# Altium project Hydro_USBL_PCB.PrjPcb
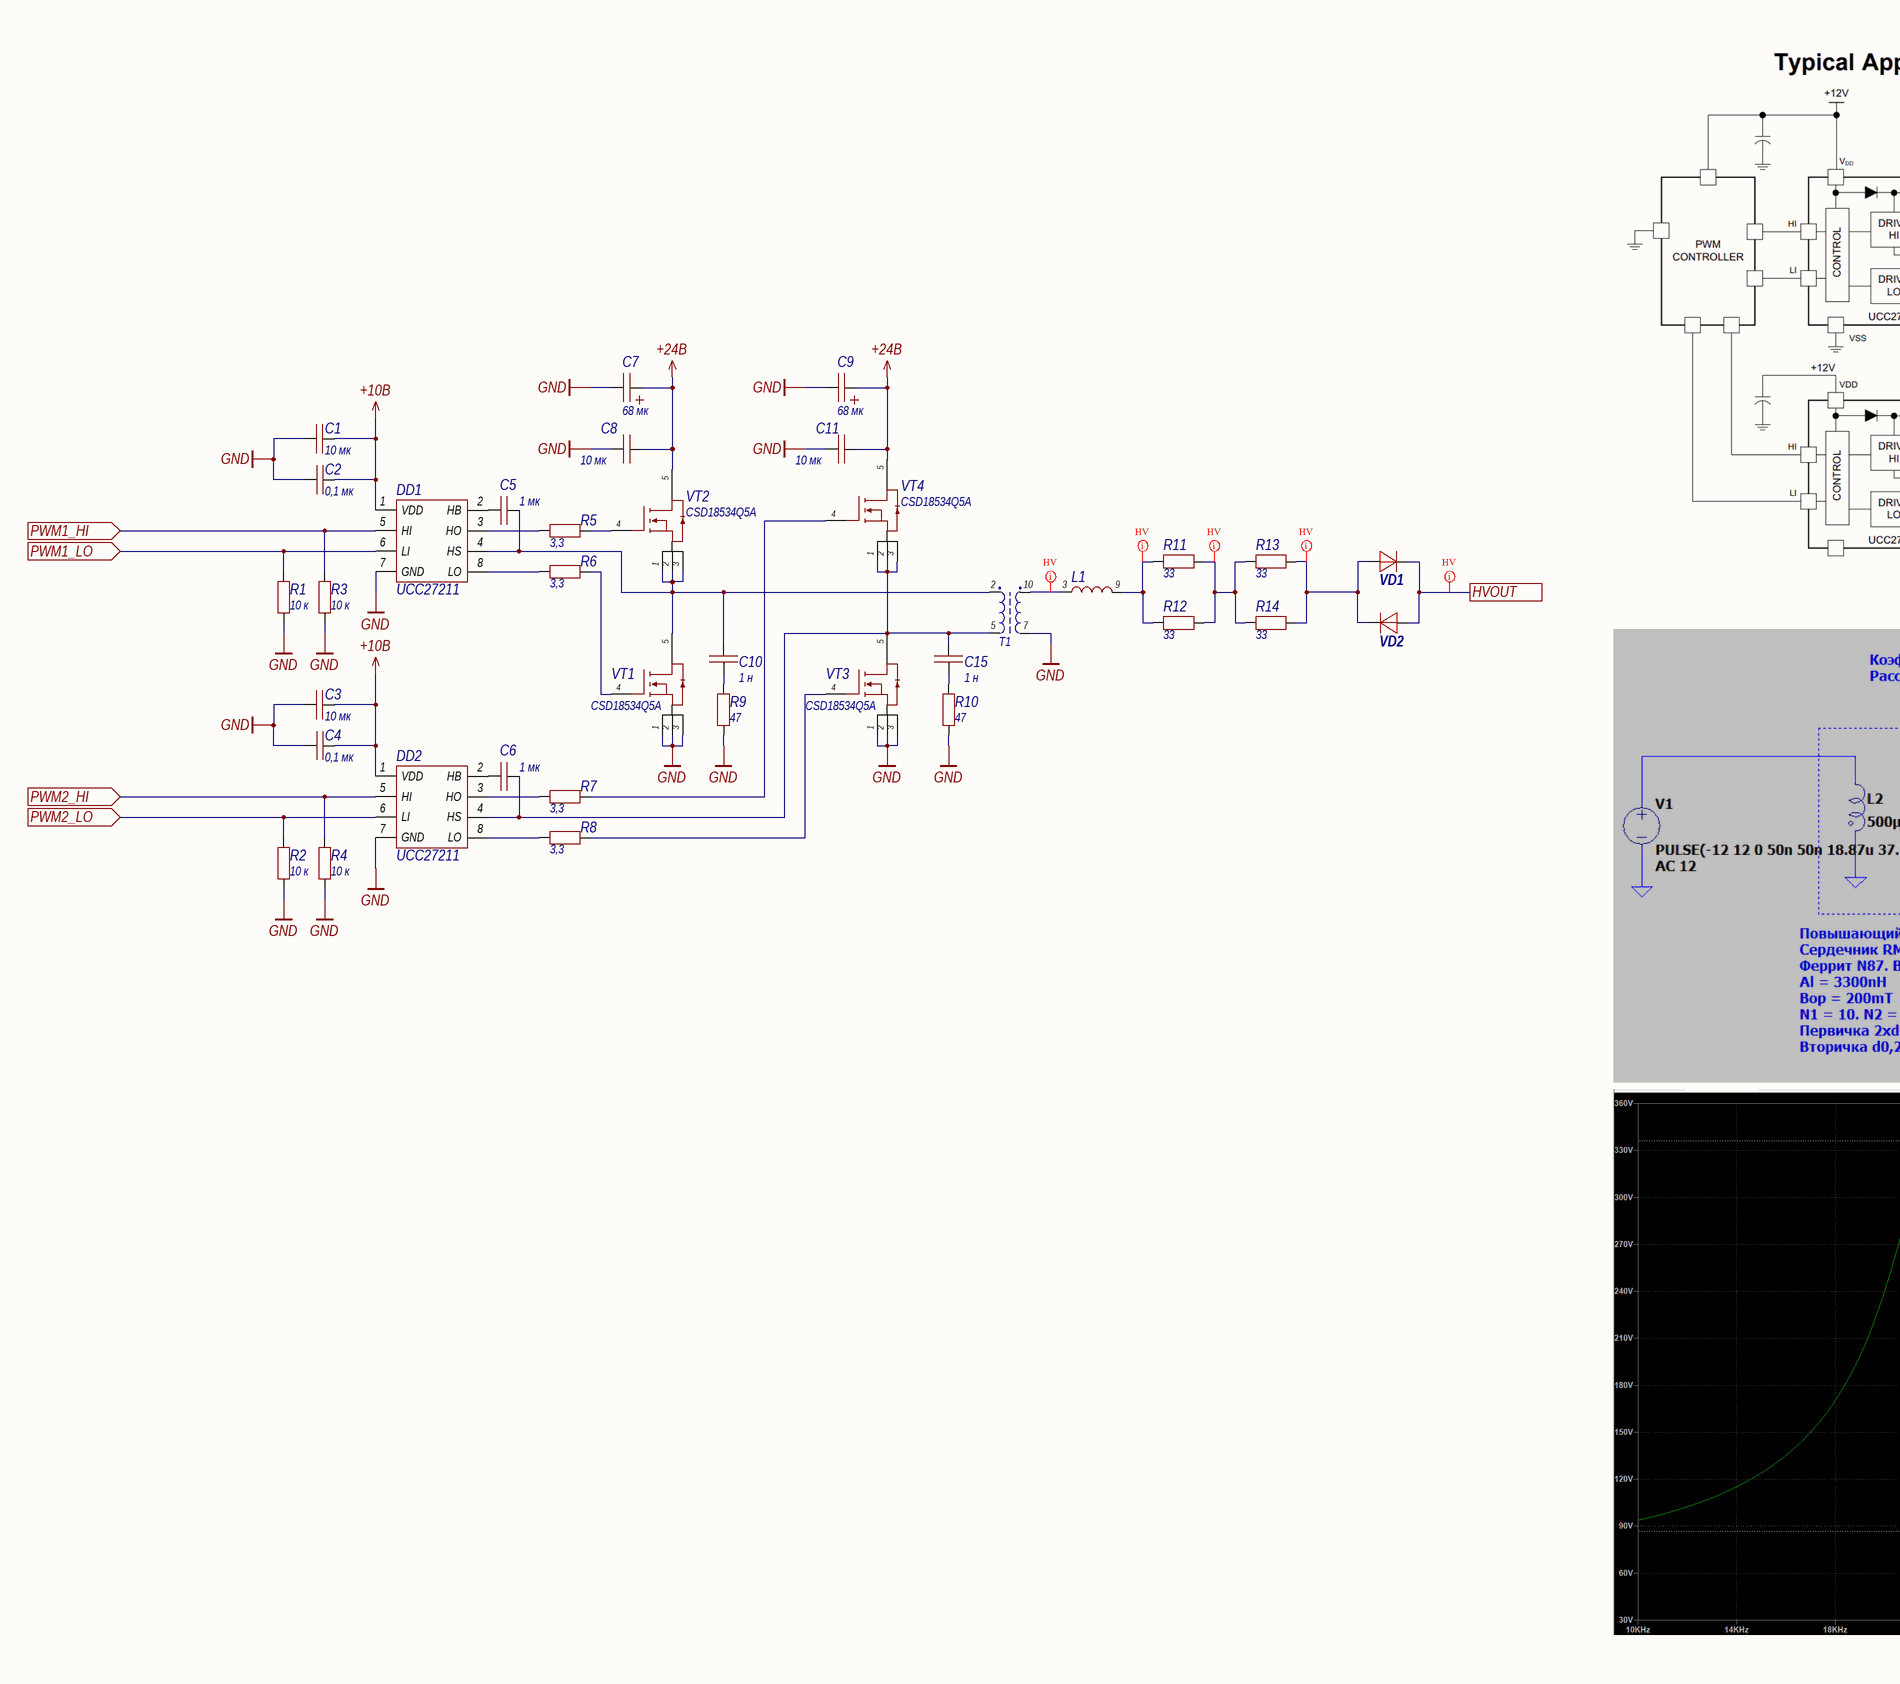
[diagram p0: HV_amplifier.SchDoc, left]
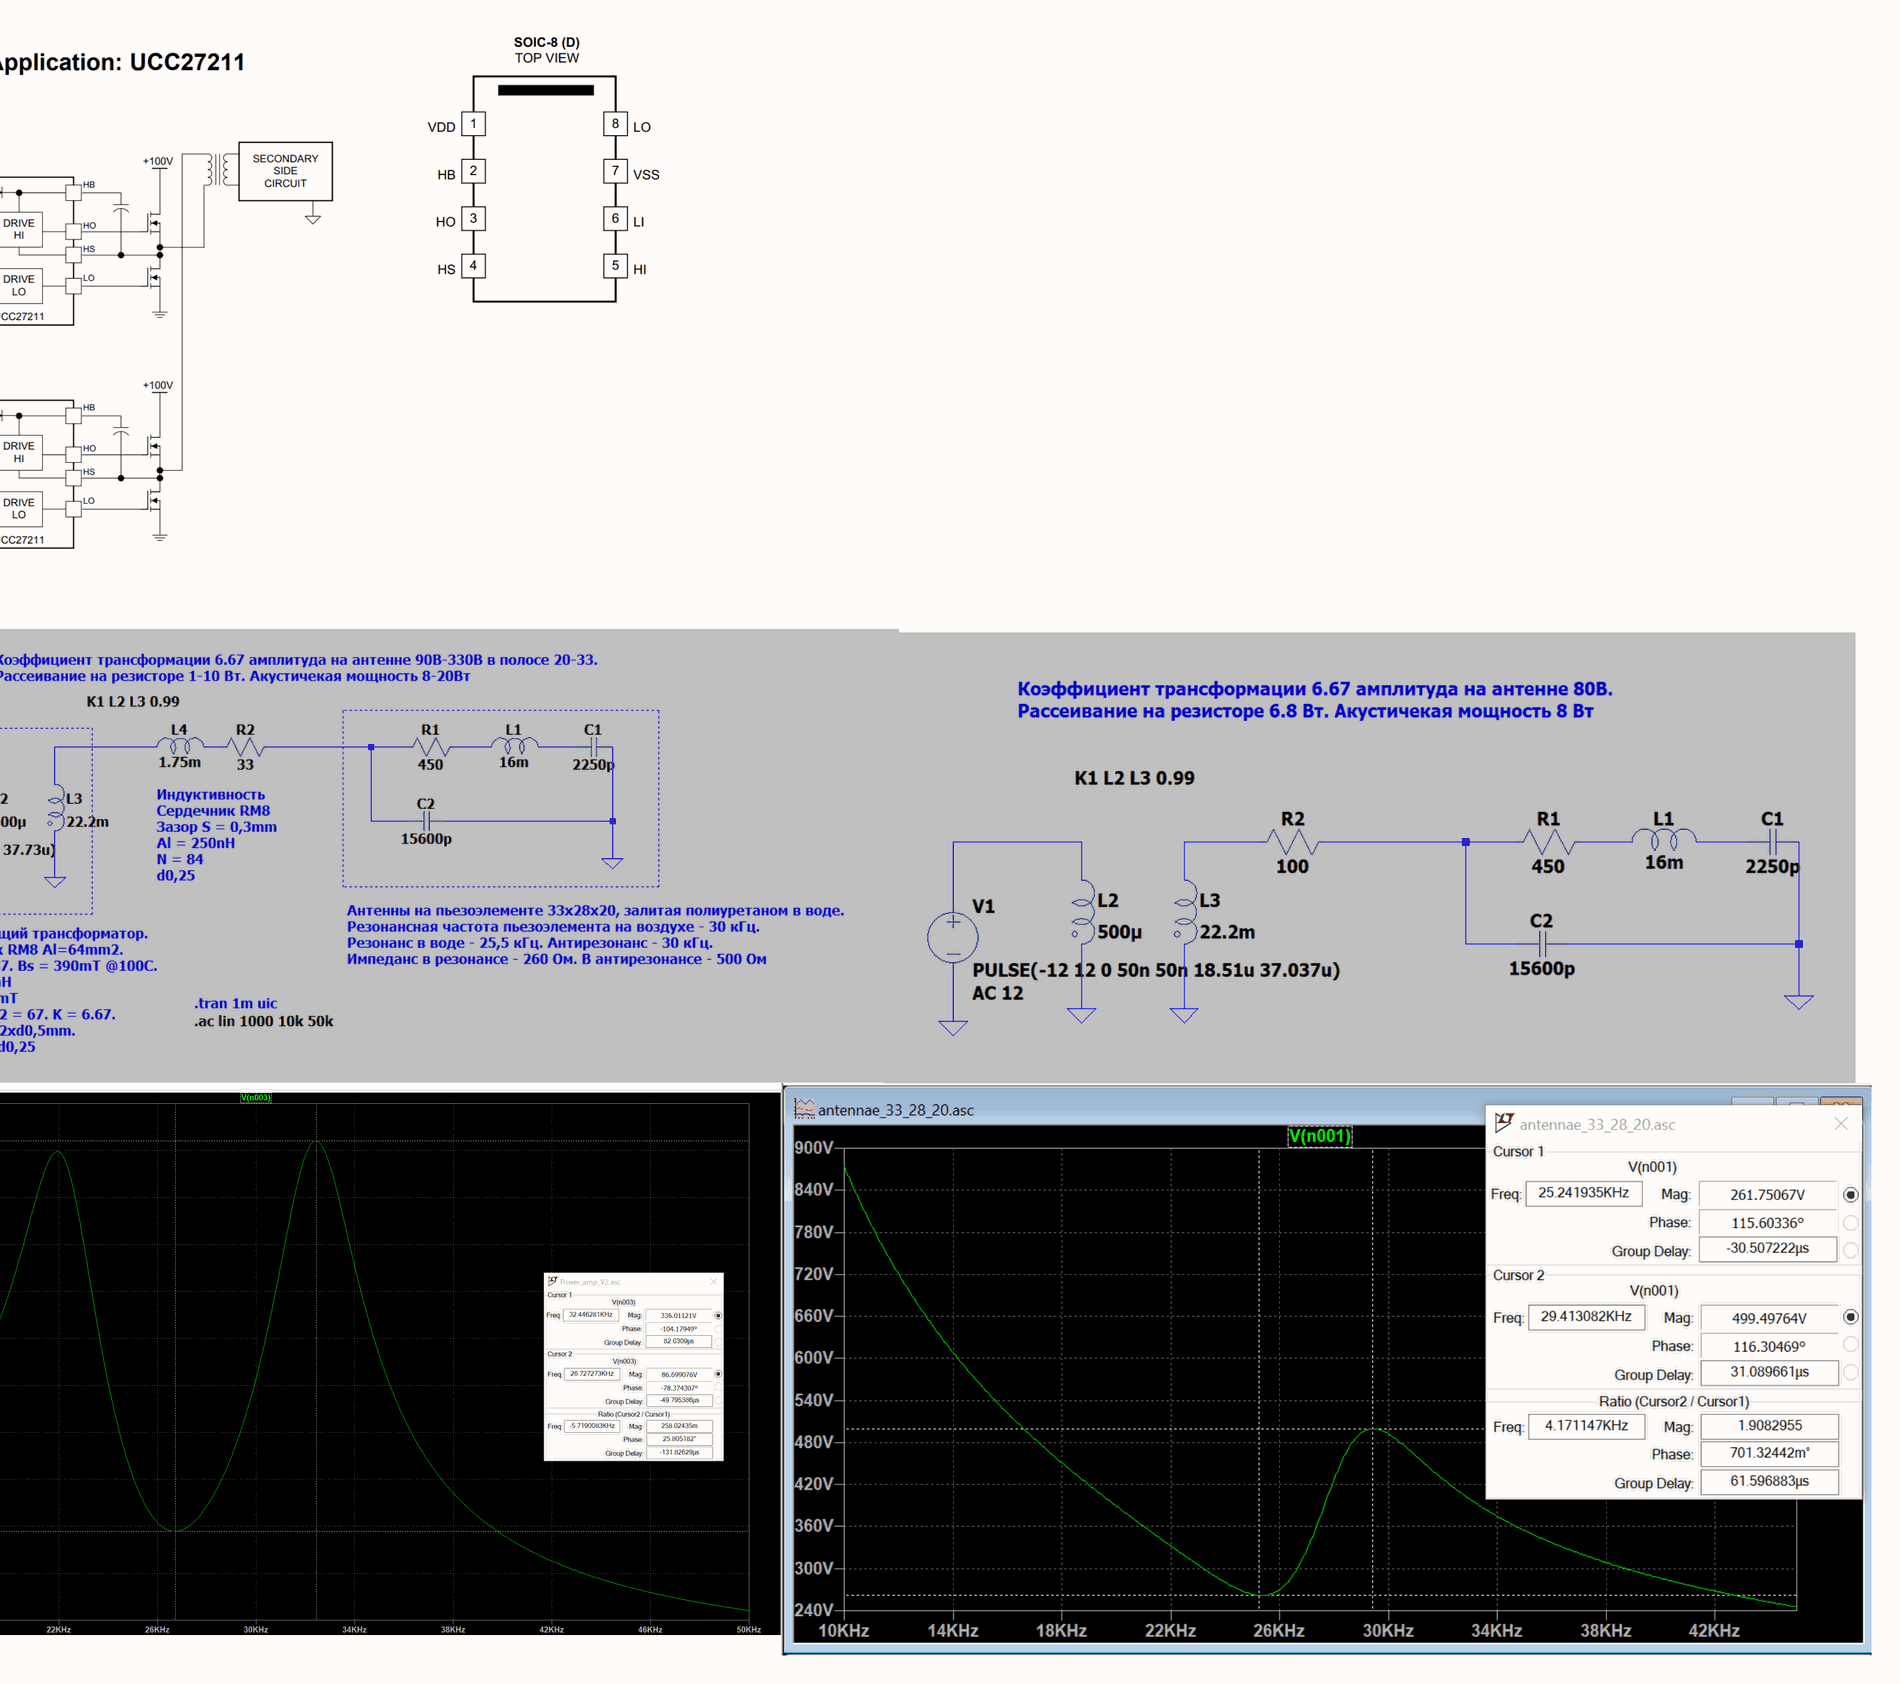
[diagram p1: HV_amplifier.SchDoc, right]
Version: 01; Title2: 15В в 300В; Title1: Преобразователь из; Title: ГАНС с короткой или ультракороткой базой; Release_Date: 16.07; DrawnBy: Михайловский Г.; Decimal_Number_Shematic: ГИДР.123456.023; Decimal_Number_PCB: ГИДР.123456.024; CheckedBy: Карманов С.
4 sheets, 134 parts. Net scope: hierarchical (ports join the sheet entries above them; power ports are global).
Board file: Hydro_USBL_PCB.PcbDoc
Sheets:
  HV_amplifier.SchDoc
  Analog_Filter.SchDoc
  MCU.SchDoc
  Connectors.SchDoc

## Sheet HV_amplifier.SchDoc: ГАНС с короткой или ультракороткой базой
size 420 x 297 mm; SheetNumber: 2; SheetTotal: 6

### Parts
C1  value 10 мк  [1210C]  (hidden comment: Capacitor)
C2  value 0,1 мк  [0603C]  (hidden comment: Capacitor)
C3  value 10 мк  [1210C]  (hidden comment: Capacitor)
C4  value 0,1 мк  [0603C]  (hidden comment: Capacitor)
C5  value 1 мк  [0603C]  (hidden comment: Capacitor)
C6  value 1 мк  [0603C]  (hidden comment: Capacitor)
C7  value 68 мк  [CAP_SMD_10x12,7]  (hidden comment: Capacitor)
C8  value 10 мк  [1210C]  (hidden comment: Capacitor)
C9  value 68 мк  [CAP_SMD_10x12,7]  (hidden comment: Capacitor)
C10  value 1 н  [0603C]  (hidden comment: Capacitor)
C11  value 10 мк  [1210C]  (hidden comment: Capacitor)
C15  value 1 н  [0603C]  (hidden comment: Capacitor)
DD1  UCC27211  [SOIC-8]
DD2  UCC27211  [SOIC-8]
L1  Inductance_RM8  [RM8_trans]  (value not drawn)
R1  value 10 к  [0603R]  (hidden comment: Resistor)
R2  value 10 к  [0603R]  (hidden comment: Resistor)
R3  value 10 к  [0603R]  (hidden comment: Resistor)
R4  value 10 к  [0603R]  (hidden comment: Resistor)
R5  value 3,3  [0603R]  (hidden comment: Resistor)
R6  value 3,3  [0603R]  (hidden comment: Resistor)
R7  value 3,3  [0603R]  (hidden comment: Resistor)
R8  value 3,3  [0603R]  (hidden comment: Resistor)
R9  value 47  [0805R]  (hidden comment: Resistor)
R10  value 47  [0805R]  (hidden comment: Resistor)
R11  value 33  [2512R]  (hidden comment: Resistor)
R12  value 33  [2512R]  (hidden comment: Resistor)
R13  value 33  [2512R]  (hidden comment: Resistor)
R14  value 33  [2512R]  (hidden comment: Resistor)
T1  Transformer_RM8  [RM8_trans]  (value not drawn)
VD1  SMA4007  [SMA]  (value not drawn)
VD2  SMA4007  [SMA]  (value not drawn)
VT1  CSD18534Q5A  [SON-8_5x6]
VT2  CSD18534Q5A  [SON-8_5x6]
VT3  CSD18534Q5A  [SON-8_5x6]
VT4  CSD18534Q5A  [SON-8_5x6]

### Ports
HVOUT, PWM1_HI (in), PWM1_LO (in), PWM2_HI (in), PWM2_LO (in)

### Nets
+10В: C1.1 C2.2 C3.1 C4.2 DD1.1(VDD) DD2.1(VDD)
+24В: C7.1 C8.2 C9.1 C11.2 VT2.5 VT4.5
GND: C1.2 C2.1 C3.2 C4.1 C7.2 C8.1 C9.2 C11.1 DD1.7(GND) DD2.7(GND) R1.1 R2.1 R3.1 R4.1 R9.1 R10.1 T1.7 VT1.1 VT1.2 VT1.3 VT3.1 VT3.2 VT3.3
NetC5_1: C5.1 DD1.2(HB)
NetC5_2: C5.2 C10.2 DD1.4(HS) T1.2 VT1.5 VT2.1 VT2.2 VT2.3
NetC6_1: C6.1 DD2.2(HB)
NetC6_2: C6.2 C15.2 DD2.4(HS) T1.5 VT3.5 VT4.1 VT4.2 VT4.3
NetC10_1: C10.1 R9.2
NetC15_1: C15.1 R10.2
NetDD1_3: DD1.3(HO) R5.1
NetDD1_5: DD1.5(HI) R3.2 ; port PWM1_HI
NetDD1_6: DD1.6(LI) R1.2 ; port PWM1_LO
NetDD1_8: DD1.8(LO) R6.1
NetDD2_3: DD2.3(HO) R7.1
NetDD2_5: DD2.5(HI) R4.2 ; port PWM2_HI
NetDD2_6: DD2.6(LI) R2.2 ; port PWM2_LO
NetDD2_8: DD2.8(LO) R8.1
NetL1_3: L1.3 T1.10
NetL1_9: L1.9 R11.1 R12.1
NetR5_2: R5.2 VT2.4
NetR6_2: R6.2 VT1.4
NetR7_2: R7.2 VT4.4
NetR8_2: R8.2 VT3.4
NetR11_2: R11.2 R12.2 R13.1 R14.1
NetR13_2: R13.2 R14.2 VD1.1 VD2.2
NetVD1_2: VD1.2 VD2.1 ; port HVOUT

### Layout directives
net class HV; rule Clearance Constraint [Clearance = 1mm]: NetL1_3, NetL1_9, NetR11_2, NetR13_2, NetVD1_2

### Notes on the sheet
- Перв. примен.
- Справ. №
- Подп. и дата
- Инв. № дубл.
- Взам. инв. №
- Инв. № подл.
- Изм.
- Лист
- № докум.
- Подп.
- Дата
- Копировал
- Формат А3

### Library data of the parts
C1 C3 C8 C11 = Capacitor_10u_10_35V_X7R_1210C: Конденсатор 1210C ёмкостью 10 мк 10%, 35 В, X7R; Voltage (V): 35; Capacity (nF): 10000; Part Number: Capacitor_10u_10_35V_X7R_1210C; Tolerance: 10%; Dielectric: X7R
C2 C4 = Capacitor_0,1u_10_50V_X7R_0603C: Конденсатор 0603C ёмкостью 0,1 мк 10%, 50 В, X7R; Voltage (V): 50; Capacity (nF): 100; Part Number: Capacitor_0,1u_10_50V_X7R_0603C; Tolerance: 10%; Dielectric: X7R
C5 C6 = Capacitor_1u_10_25V_X7R_0603C: Конденсатор 0603C ёмкостью 1 мк 10%, 25 В, X7R; Voltage (V): 25; Capacity (nF): 1000; Part Number: Capacitor_1u_10_25V_X7R_0603C; Tolerance: 10%; Dielectric: X7R
C7 C9 = 50SVPF68M: Конденсатор алюминиевый полимерный 68мкФ 50В ±20% (10х12.6мм) для поверхностного монтажа 0.02Ом 4300мА 5000час 105°С; Tolerance: 20; Voltage (V): 50; Type: SMD Aluminum; Capacity (uF): 68; Автор: glebmih; Datasheet: http://cdn.promelec.ru/upload/items/2022/11/10/SVPF-Series_.pdf; Part Number: 50SVPF68M
C10 C15 = Capacitor_1n_5_50V_NP0_0603C: Конденсатор 0603C ёмкостью 1 н 5%, 50 В, NP0; Voltage (V): 50; Capacity (nF): 1; Автор: glebmih; Part Number: Capacitor_1n_5_50V_NP0_0603C; Tolerance: 5%; Dielectric: NP0
DD1 DD2 = UCC27211: Полумостовой драйвер затвора для mosfet транзисторов; Автор: glebmih; Part Number: UCC27211; Datasheet: https://static.chipdip.ru/lib/348/DOC032348430.pdf
L1 = Inductance_RM8: Индуктивность на сердечнике RM8; Автор: glebmih; Part Number: Inductance_RM8; Datasheet: https://static.chipdip.ru/lib/153/DOC004153919.pdf
R1-R4 = Resistor_10k_1_0603: Резистор номиналом 10 кОм 1%; Power: *; Part Number: Resistor_10k_1_0603; Tolerance: 1%
R5-R8 = Resistor_3.3_1_0603: Резистор номиналом 3,3 Ом 1%; Power: *; Part Number: Resistor_3.3_1_0603; Tolerance: 1%
R9 R10 = Resistor_47_1_0805: Резистор номиналом 47 Ом 1%; Автор: glebmih; Power: *; Part Number: Resistor_47_1_0805; Tolerance: 1%
R11-R14 = Resistor_33_1_2512: Резистор номиналом 33 Ом 1%; Автор: glebmih; Power: *; Part Number: Resistor_33_1_2512; Tolerance: 1%
T1 = Transformer_RM8: Трансформатор на сердечнике RM8; Автор: glebmih; Part Number: Transformer_RM8; Datasheet: https://static.chipdip.ru/lib/153/DOC004153919.pdf
VD1 VD2 = SMA4007: Выпрямительный диод на 1000 В, ном. ток 1 А А; Voltage (V): 1000; Current: 1 А; Автор: glebmih; Part Number: SMA4007; Datasheet: https://static.chipdip.ru/lib/867/DOC050867185.pdf
VT1-VT4 = CSD18534Q5A: N-канальный MOSFET, 60 В, 50 А; Voltage (V): 60 В; Current (A): 50 А; Автор: glebmih; Part Number: CSD18534Q5A; Datasheet: https://static.chipdip.ru/lib/647/DOC053647214.pdf

## Sheet Analog_Filter.SchDoc: ГАНС с короткой или ультракороткой базой
size 420 x 297 mm; SheetNumber: 3; SheetTotal: 6
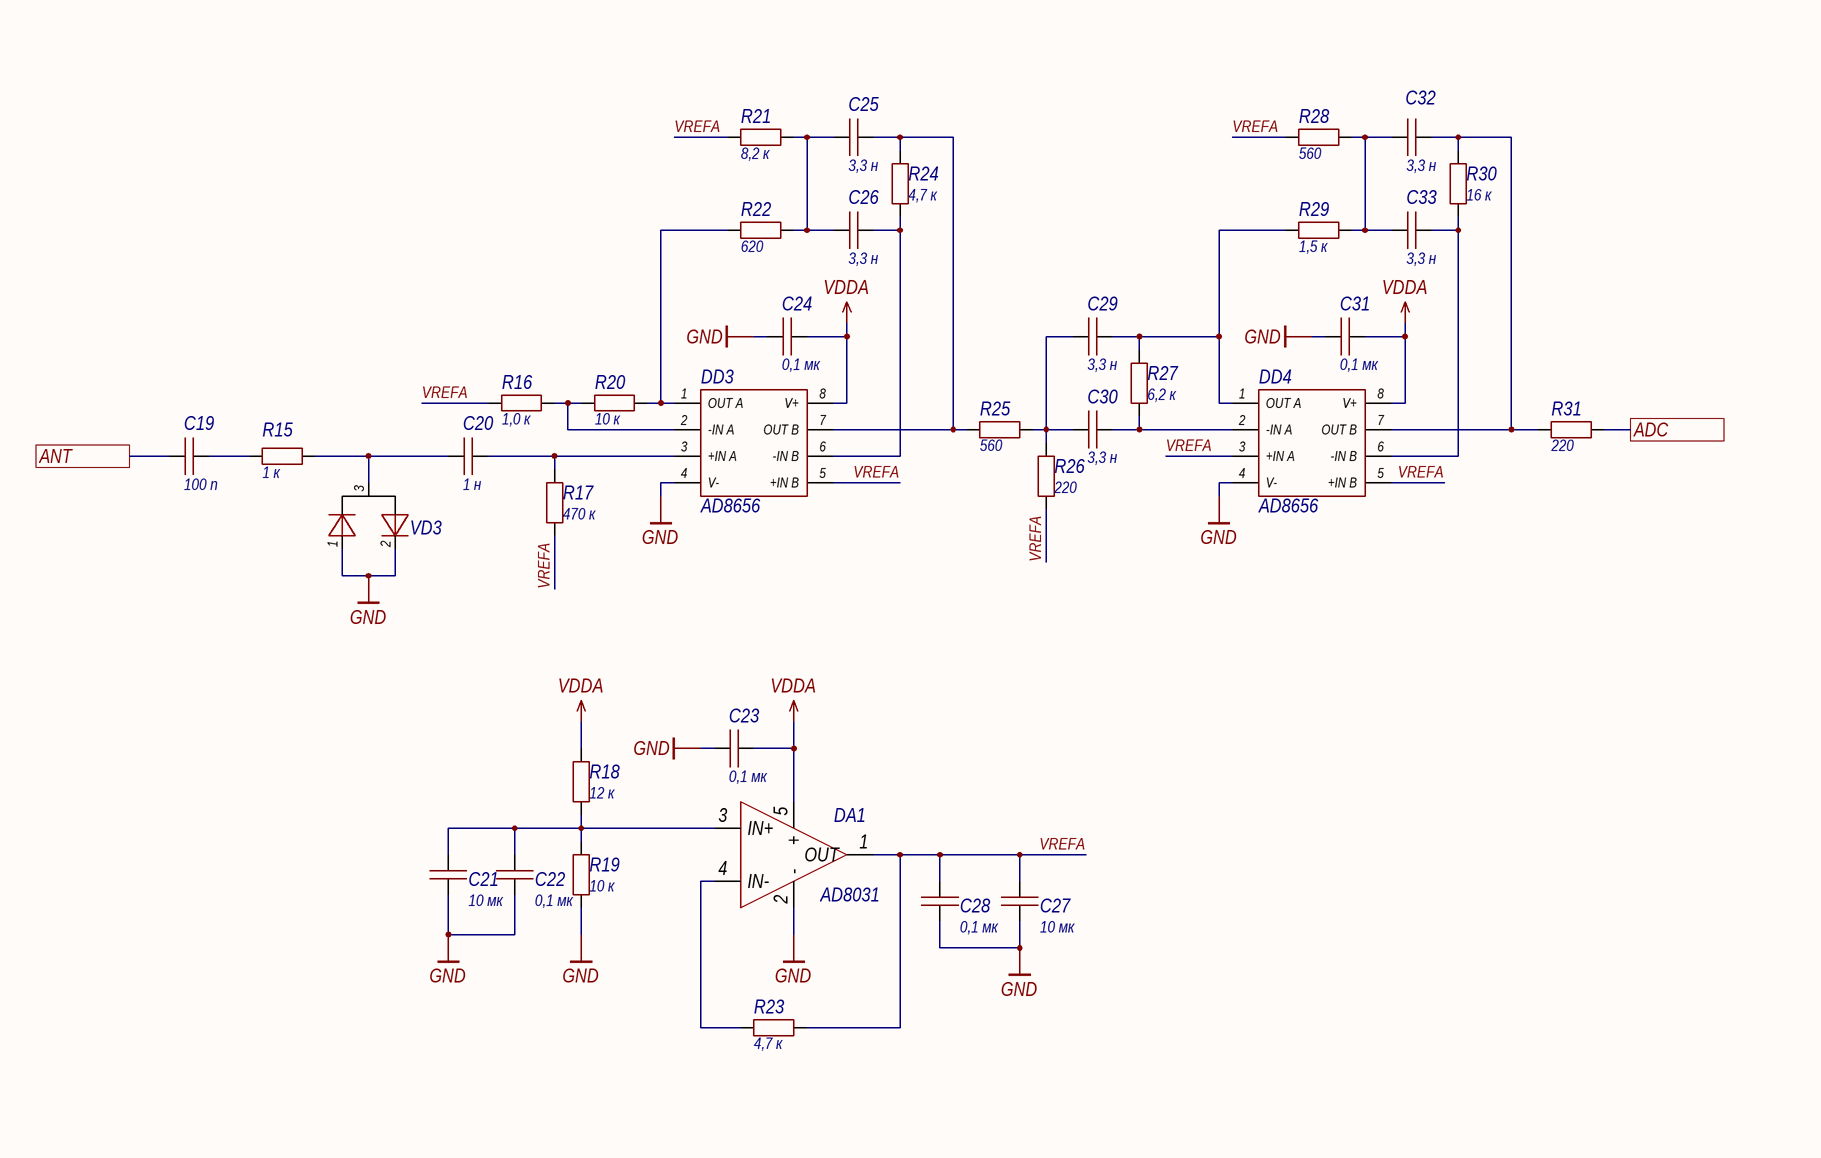
[diagram p2: Analog_Filter.SchDoc, left]
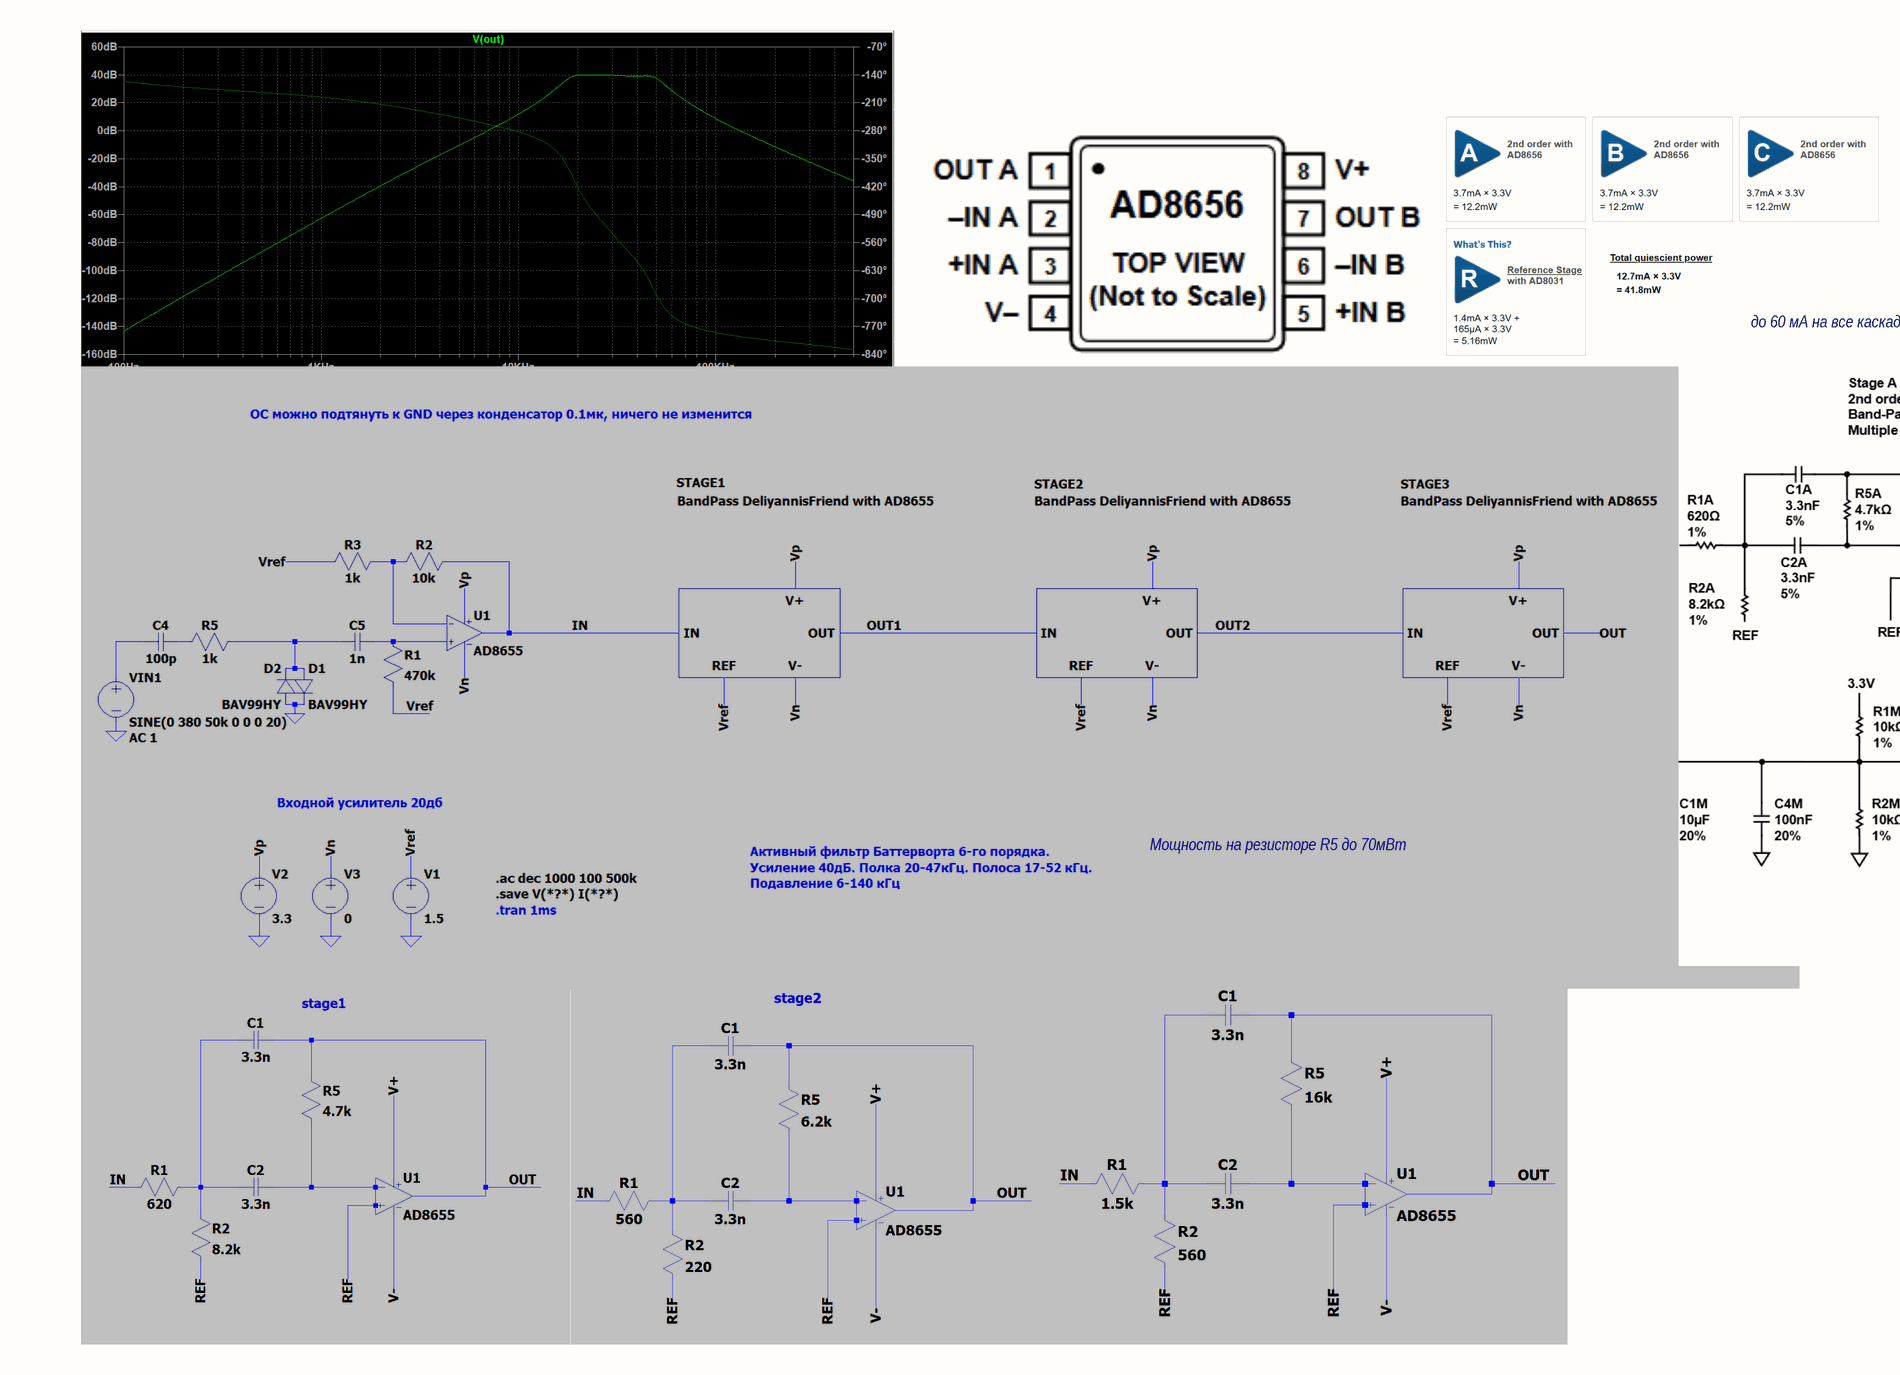
[diagram p3: Analog_Filter.SchDoc, middle]
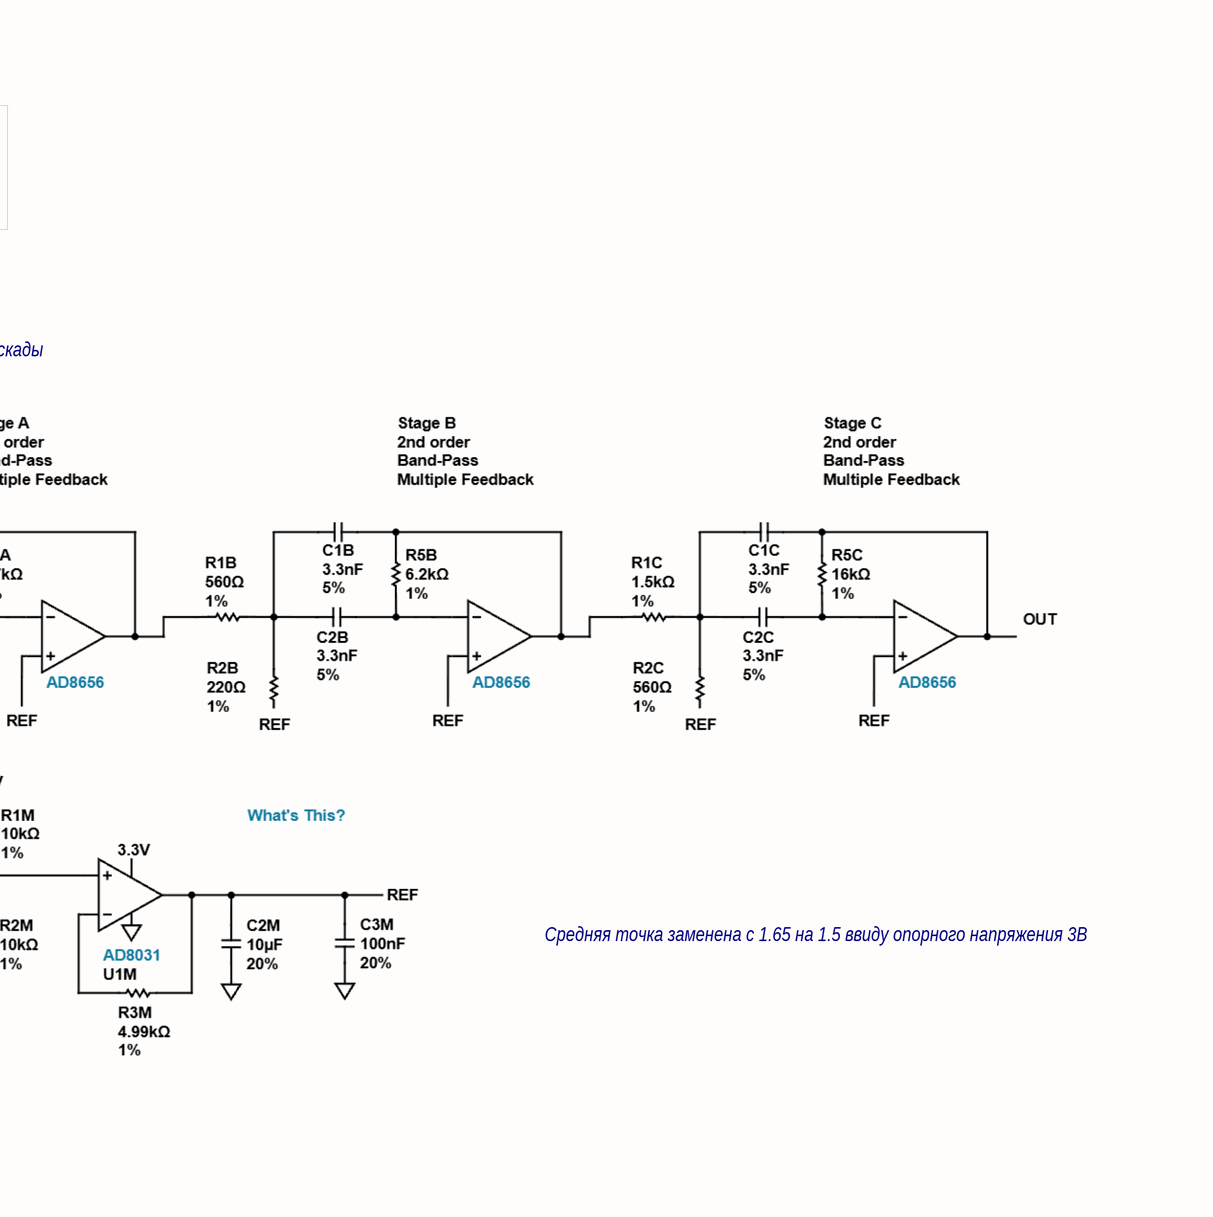
[diagram p4: Analog_Filter.SchDoc, right]

### Parts
C19  value 100 п  [1206C]  (hidden comment: Capacitor)
C20  value 1 н  [0603C]  (hidden comment: Capacitor)
C21  value 10 мк  [0603C]  (hidden comment: Capacitor)
C22  value 0,1 мк  [0603C]  (hidden comment: Capacitor)
C23  value 0,1 мк  [0603C]  (hidden comment: Capacitor)
C24  value 0,1 мк  [0603C]  (hidden comment: Capacitor)
C25  value 3,3 н  [0603C]  (hidden comment: Capacitor)
C26  value 3,3 н  [0603C]  (hidden comment: Capacitor)
C27  value 10 мк  [0603C]  (hidden comment: Capacitor)
C28  value 0,1 мк  [0603C]  (hidden comment: Capacitor)
C29  value 3,3 н  [0603C]  (hidden comment: Capacitor)
C30  value 3,3 н  [0603C]  (hidden comment: Capacitor)
C31  value 0,1 мк  [0603C]  (hidden comment: Capacitor)
C32  value 3,3 н  [0603C]  (hidden comment: Capacitor)
C33  value 3,3 н  [0603C]  (hidden comment: Capacitor)
DA1  AD8031  [SOT23-5]
DD3  AD8656  [SOIC-8]
DD4  AD8656  [SOIC-8]
R15  value 1 к  [0805R]  (hidden comment: Resistor)
R16  value 1,0 к  [0603R]  (hidden comment: Resistor)
R17  value 470 к  [0603R]  (hidden comment: Resistor)
R18  value 12 к  [0603R]  (hidden comment: Resistor)
R19  value 10 к  [0603R]  (hidden comment: Resistor)
R20  value 10 к  [0603R]  (hidden comment: Resistor)
R21  value 8,2 к  [0603R]  (hidden comment: Resistor)
R22  value 620  [0603R]  (hidden comment: Resistor)
R23  value 4,7 к  [0603R]  (hidden comment: Resistor)
R24  value 4,7 к  [0603R]  (hidden comment: Resistor)
R25  value 560  [0603R]  (hidden comment: Resistor)
R26  value 220  [0603R]  (hidden comment: Resistor)
R27  value 6,2 к  [0603R]  (hidden comment: Resistor)
R28  value 560  [0603R]  (hidden comment: Resistor)
R29  value 1,5 к  [0603R]  (hidden comment: Resistor)
R30  value 16 к  [0603R]  (hidden comment: Resistor)
R31  value 220  [0603R]  (hidden comment: Resistor)
VD3  BAV99  [SOT23-3]  (value not drawn)

### Ports
ADC, ANT

### Nets
GND: C21.1 C22.1 C23.1 C24.1 C27.1 C28.1 C31.1 DA1.2(-) DD3.4(V-) DD4.4(V-) R19.1 VD3.1 VD3.2
VDDA: C23.2 C24.2 C31.2 DA1.5(+) DD3.8(V+) DD4.8(V+) R18.2
VREFA: C27.2 C28.2 DA1.1(OUT) DD3.5(+IN_B) DD4.3(+IN_A) DD4.5(+IN_B) R16.1 R17.1 R21.2 R23.2 R26.1 R28.1  [project net VREFA_3]
NetC19_1: C19.1 ; port ANT
NetC19_2: C19.2 R15.1
NetC20_1: C20.1 R15.2 VD3.3
NetC20_2: C20.2 DD3.3(+IN_A) R17.2
NetC21_2: C21.2 C22.2 DA1.3(IN+) R18.1 R19.2
NetC25_1: C25.1 C26.1 R21.1 R22.2
NetC25_2: C25.2 DD3.7(OUT_B) R24.1 R25.1
NetC26_2: C26.2 DD3.6(-IN_B) R24.2
NetC29_1: C29.1 C30.1 R25.2 R26.2
NetC29_2: C29.2 DD4.1(OUT_A) R27.2 R29.1
NetC30_2: C30.2 DD4.2(-IN_A) R27.1
NetC32_1: C32.1 C33.1 R28.2 R29.2
NetC32_2: C32.2 DD4.7(OUT_B) R30.2 R31.1
NetC33_2: C33.2 DD4.6(-IN_B) R30.1
NetDA1_4: DA1.4(IN-) R23.1
NetDD3_1: DD3.1(OUT_A) R20.2 R22.1
NetDD3_2: DD3.2(-IN_A) R16.2 R20.1
NetR31_2: R31.2 ; port ADC

### Notes on the sheet
- до 60 мА на все каскады
- Мощность на резисторе R5 до 70мВт
- Средняя точка заменена с 1.65 на 1.5 ввиду опорного напряжения 3В
- Перв. примен.
- Справ. №
- Подп. и дата
- Инв. № дубл.
- Взам. инв. №
- Инв. № подл.
- Изм.
- Лист
- № докум.
- Подп.
- Дата
- Копировал
- Формат А3

### Library data of the parts
C19 = Capacitor_100p_5_630V_NP0_1206C: Конденсатор 1206C ёмкостью 100 п 5%, 630 В, NP0; Voltage (V): 630; Capacity (nF): 0,1; Автор: glebmih; Part Number: Capacitor_100p_5_630V_NP0_1206C; Tolerance: 5%; Dielectric: NP0
C20 = Capacitor_1n_5_50V_NP0_0603C: as C10 on sheet HV_amplifier; Part Number: Capacitor_1n_5_50V_NP0_0603C; Tolerance: 5%; Dielectric: NP0
C21 C27 = Capacitor_10u_10_10V_X7R_0603C: Конденсатор 0603C ёмкостью 10 мк 10%, 10 В, X7R; Voltage (V): 10; Capacity (nF): 10000; Автор: glebmih; Datasheet: https://static.chipdip.ru/lib/893/DOC031893419.pdf; Part Number: Capacitor_10u_10_10V_X7R_0603C; Tolerance: 10%; Dielectric: X7R
C22-C24 C28 C31 = Capacitor_0,1u_10_50V_X7R_0603C: as C2 on sheet HV_amplifier; Part Number: Capacitor_0,1u_10_50V_X7R_0603C; Tolerance: 10%; Dielectric: X7R
C25 C26 C29 C30 C32 C33 = Capacitor_3.3n_5_50V_NP0_0603C: Конденсатор 0603C ёмкостью 3,3 н 5%, 50 В, NP0; Voltage (V): 50; Capacity (nF): 3,3; Автор: glebmih; Part Number: Capacitor_3.3n_5_50V_NP0_0603C; Tolerance: 5%; Dielectric: NP0
DA1 = AD8031: Операционный усилитель, 80МГц, 1-канал, 35В/мкс, Voltage Feedback, Rail-to-Rail; Автор: glebmih; Part Number: AD8031; Datasheet: https://static.chipdip.ru/lib/262/DOC005262075.pdf
DD3 DD4 = AD8656: Операционный усилитель 28МГц, CMOS, 2-канала, Rail-to-Rail; Автор: glebmih; Part Number: AD8656; Datasheet: https://static.chipdip.ru/lib/442/DOC011442004.pdf
R15 = Resistor_1k_0805: Резистор номиналом 1 кОм 1%; Автор: glebmih; Power: *; Part Number: Resistor_1k_0805; Tolerance: 1%
R16 = Resistor_1.0k_1_0603: Резистор номиналом 1,0 кОм 1%; Power: *; Part Number: Resistor_1.0k_1_0603; Tolerance: 1%
R17 = Resistor_470k_1_0603: Резистор номиналом 470 кОм 1%; Power: *; Part Number: Resistor_470k_1_0603; Tolerance: 1%
R18 = Resistor_12k_1_0603: Резистор номиналом 12 кОм 1%; Power: *; Part Number: Resistor_12k_1_0603; Tolerance: 1%
R19 R20 = Resistor_10k_1_0603: Резистор номиналом 10 кОм 1%; Power: *; Part Number: Resistor_10k_1_0603; Tolerance: 1%
R21 = Resistor_8.2k_1_0603: Резистор номиналом 8,2 кОм 1%; Power: *; Part Number: Resistor_8.2k_1_0603; Tolerance: 1%
R22 = Resistor_620_1_0603: Резистор номиналом 620 Ом 1%; Power: *; Part Number: Resistor_620_1_0603; Tolerance: 1%
R23 R24 = Resistor_4.7k_1_0603: Резистор номиналом 4,7 кОм 1%; Power: *; Part Number: Resistor_4.7k_1_0603; Tolerance: 1%
R25 R28 = Resistor_560_1_0603: Резистор номиналом 560 Ом 1%; Power: *; Part Number: Resistor_560_1_0603; Tolerance: 1%
R26 R31 = Resistor_220_1_0603: Резистор номиналом 220 Ом 1%; Power: *; Part Number: Resistor_220_1_0603; Tolerance: 1%
R27 = Resistor_6.2k_1_0603: Резистор номиналом 6,2 кОм 1%; Power: *; Part Number: Resistor_6.2k_1_0603; Tolerance: 1%
R29 = Resistor_1.5k_1_0603: Резистор номиналом 1,5 кОм 1%; Power: *; Part Number: Resistor_1.5k_1_0603; Tolerance: 1%
R30 = Resistor_16k_1_0603: Резистор номиналом 16 кОм 1%; Power: *; Part Number: Resistor_16k_1_0603; Tolerance: 1%
VD3 = BAV99: Диод импульсный, 2 х 0.2А, 70В, последовательное включение; Voltage (V): 70; Current: 0.2; Автор: glebmih; Part Number: BAV99; Datasheet: https://static.chipdip.ru/lib/931/DOC030931559.pdf

## Sheet MCU.SchDoc: ГАНС с короткой или ультракороткой базой
size 420 x 297 mm; SheetNumber: 4; SheetTotal: 6
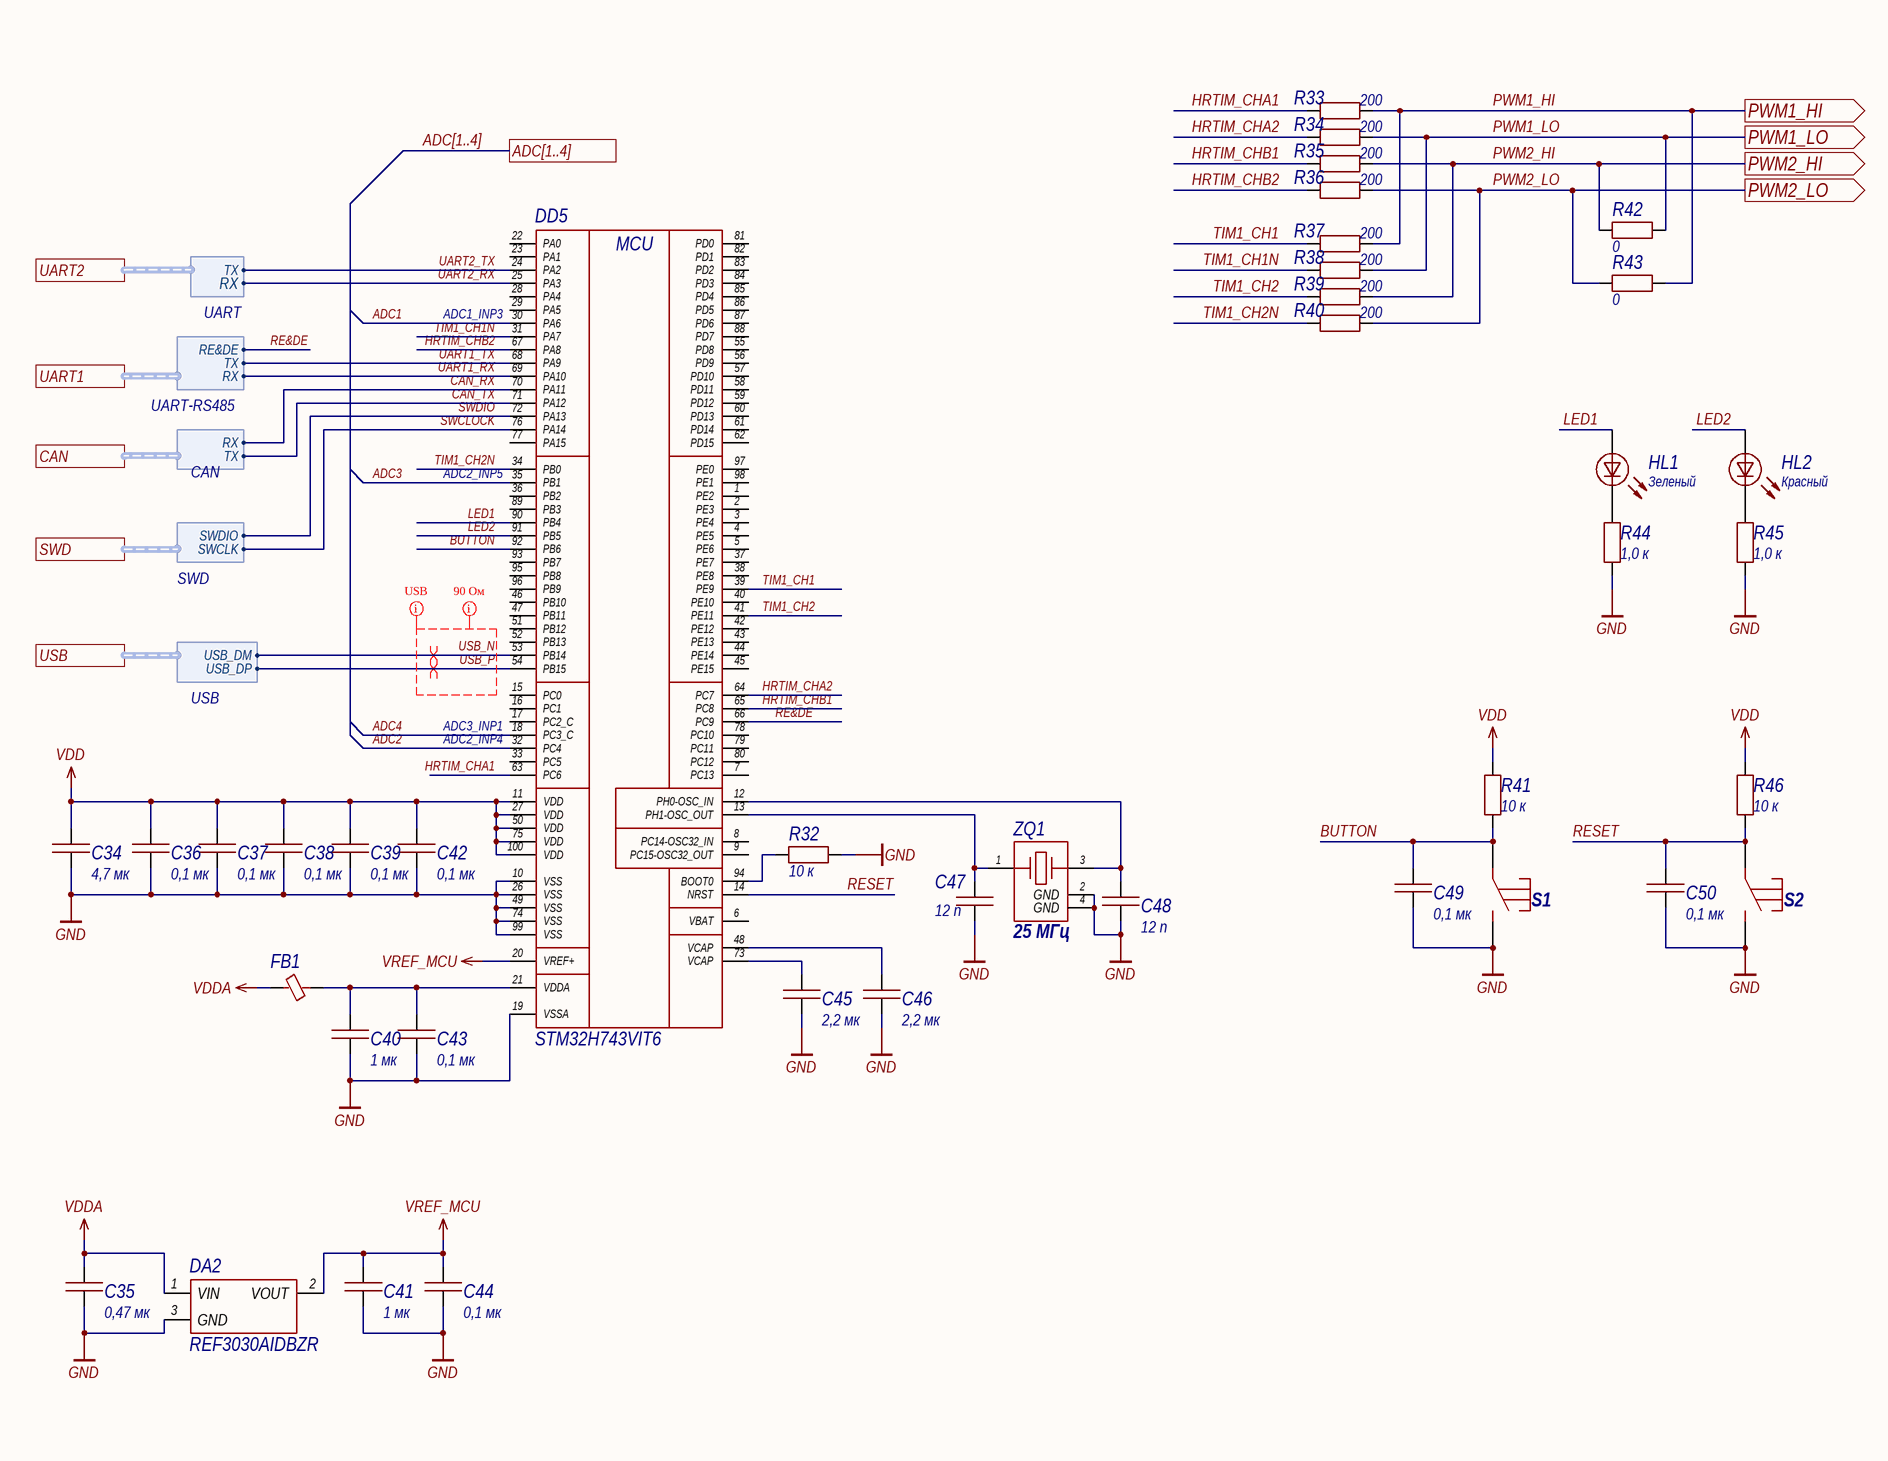
[diagram p5: MCU.SchDoc, left]
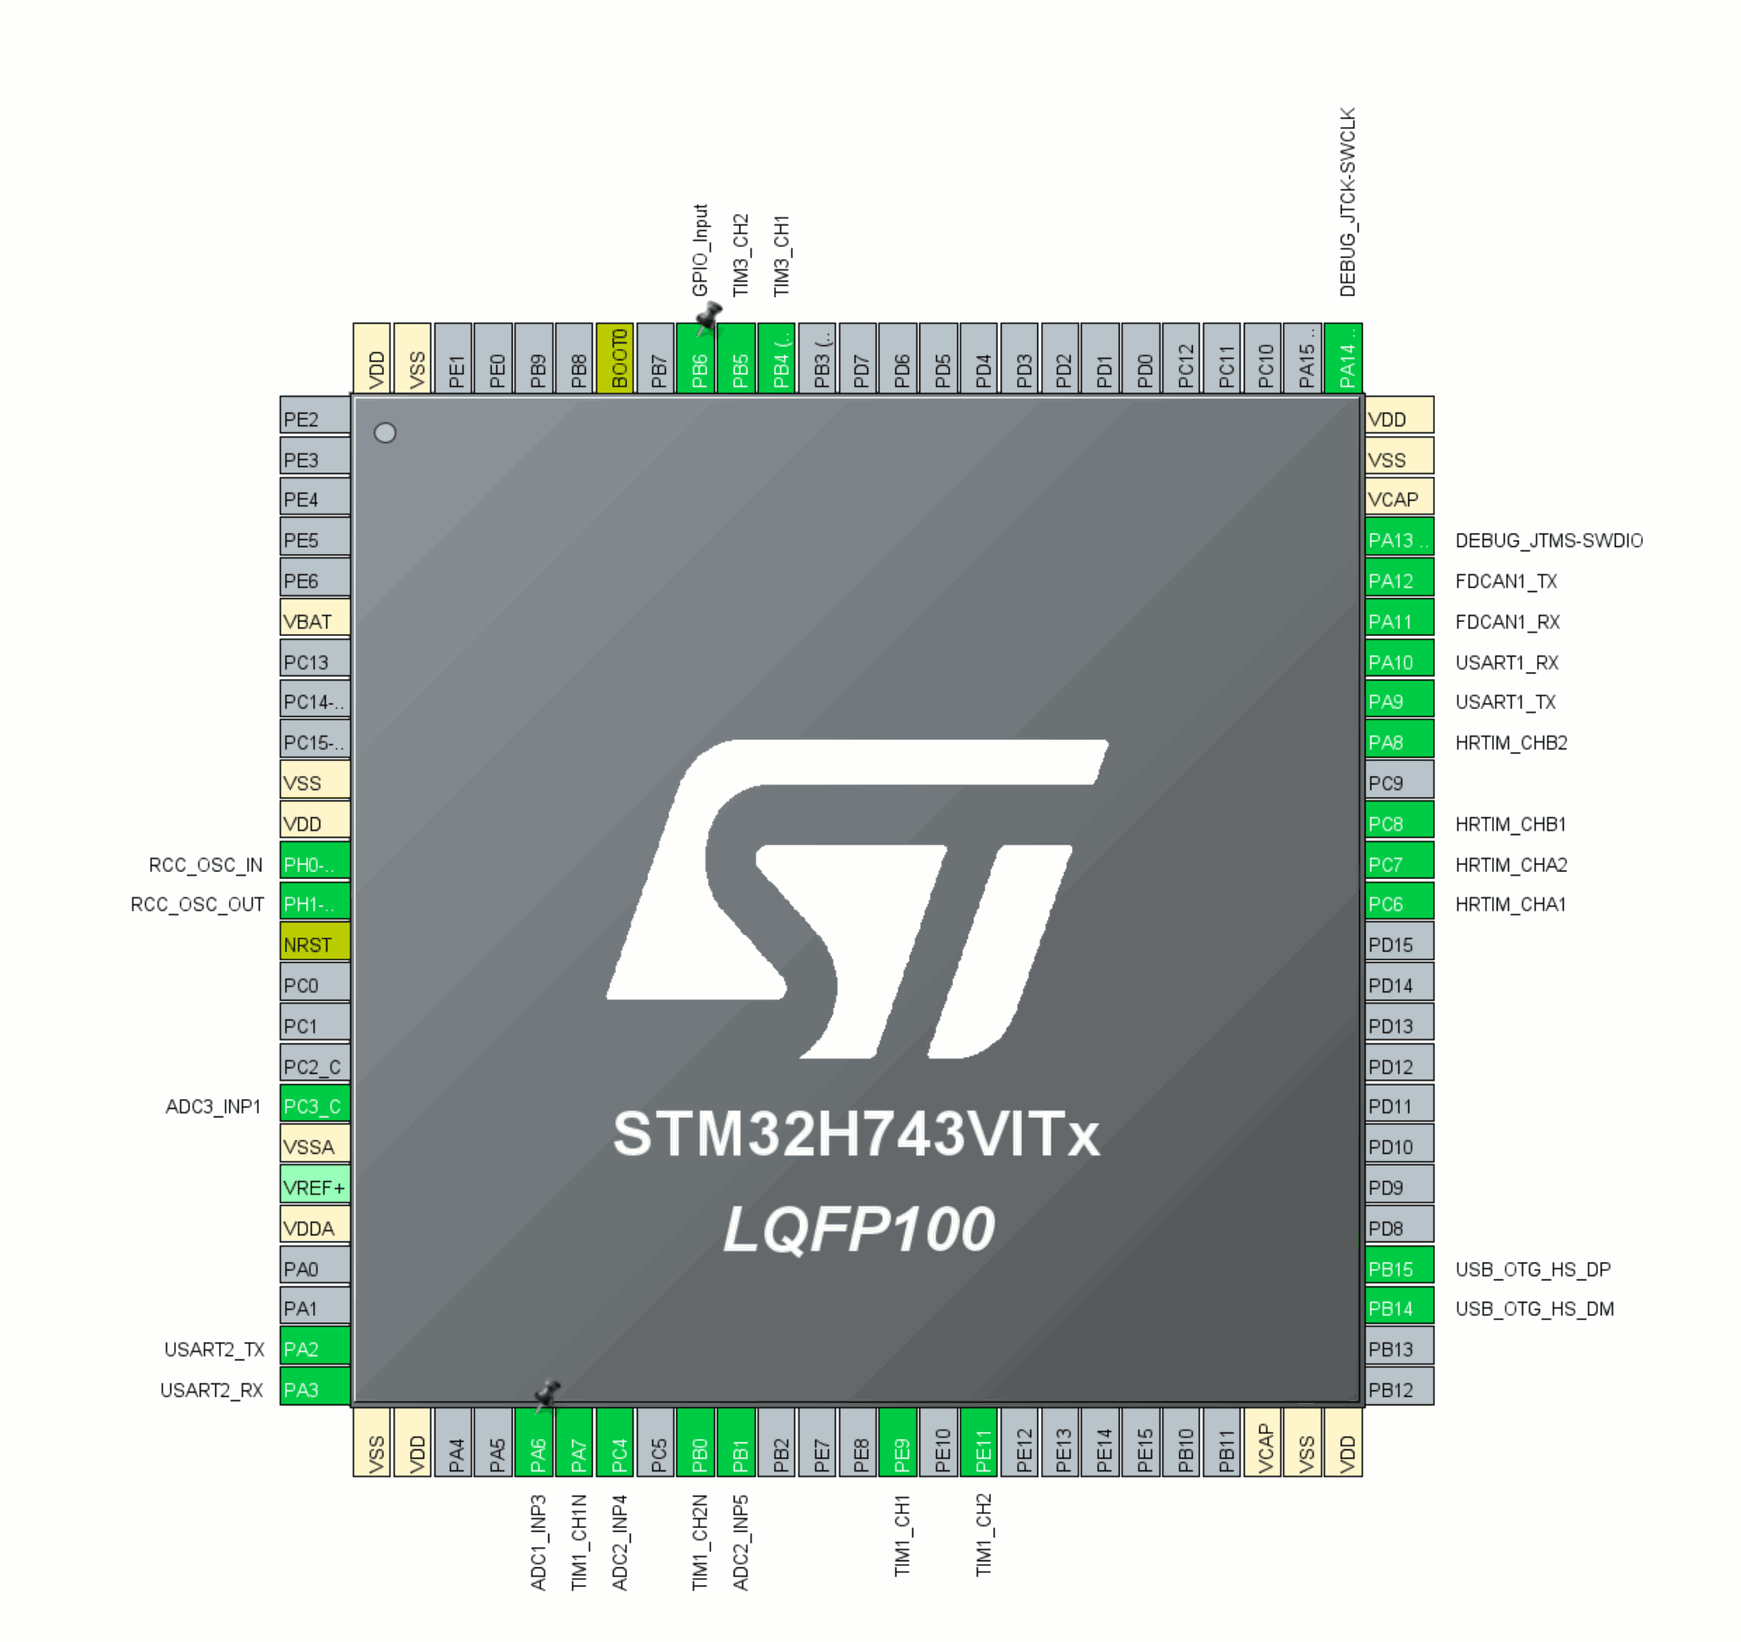
[diagram p6: MCU.SchDoc, right]

### Parts
C34  value 4,7 мк  [1206C]  (hidden comment: Capacitor)
C35  value 0,47 мк  [0603C]  (hidden comment: Capacitor)
C36  value 0,1 мк  [0603C]  (hidden comment: Capacitor)
C37  value 0,1 мк  [0603C]  (hidden comment: Capacitor)
C38  value 0,1 мк  [0603C]  (hidden comment: Capacitor)
C39  value 0,1 мк  [0603C]  (hidden comment: Capacitor)
C40  value 1 мк  [0603C]  (hidden comment: Capacitor)
C41  value 1 мк  [0603C]  (hidden comment: Capacitor)
C42  value 0,1 мк  [0603C]  (hidden comment: Capacitor)
C43  value 0,1 мк  [0603C]  (hidden comment: Capacitor)
C44  value 0,1 мк  [0603C]  (hidden comment: Capacitor)
C45  value 2,2 мк  [1206C]  (hidden comment: Capacitor)
C46  value 2,2 мк  [1206C]  (hidden comment: Capacitor)
C47  value 12 п  [0603C]  (hidden comment: Capacitor)
C48  value 12 п  [0603C]  (hidden comment: Capacitor)
C49  value 0,1 мк  [0603C]  (hidden comment: Capacitor)
C50  value 0,1 мк  [0603C]  (hidden comment: Capacitor)
DA2  REF3030AIDBZR  [SOT23-3]
DD5  STM32H743VIT6  [LQFP100]
FB1  BLM18AG102SN1D  [0603L]  (value not drawn)
HL1  value Зеленый  [0805D]  (hidden comment: LED)
HL2  value Красный  [0805D]  (hidden comment: LED)
R32  value 10 к  [0603R]  (hidden comment: Resistor)
R33  value 200  [0603R]  (hidden comment: Resistor)
R34  value 200  [0603R]  (hidden comment: Resistor)
R35  value 200  [0603R]  (hidden comment: Resistor)
R36  value 200  [0603R]  (hidden comment: Resistor)
R37  value 200  [0603R]  (hidden comment: Resistor)
R38  value 200  [0603R]  (hidden comment: Resistor)
R39  value 200  [0603R]  (hidden comment: Resistor)
R40  value 200  [0603R]  (hidden comment: Resistor)
R41  value 10 к  [0603R]  (hidden comment: Resistor)
R42  value 0  [0603R]  (hidden comment: Resistor)
R43  value 0  [0603R]  (hidden comment: Resistor)
R44  value 1,0 к  [0603R]  (hidden comment: Resistor)
R45  value 1,0 к  [0603R]  (hidden comment: Resistor)
R46  value 10 к  [0603R]  (hidden comment: Resistor)
S1  TSS-TD-19XA-XTR  [TSS-TD-19XA-XTR]  (value not drawn)
S2  TSS-TD-19XA-XTR  [TSS-TD-19XA-XTR]  (value not drawn)
ZQ1  value 25 МГц  [X322525MOB4SI]  (hidden comment: X322525MOB4SI)

### Ports
ADC[1..4], CAN (harness CAN), PWM1_HI (out), PWM1_LO (out), PWM2_HI (out), PWM2_LO (out), SWD (harness SWD), UART1 (harness UART-RS485), UART2 (harness UART), USB (harness USB)

### Harnesses
UART: TX, RX
UART-RS485: TX, RX, RE&DE
USB: USB_DM, USB_DP
SWD: SWDIO, SWCLK
CAN: TX, RX

### Nets
GND: C34.1 C35.1 C36.1 C37.1 C38.1 C39.1 C40.1 C41.1 C42.1 C43.1 C44.1 C45.1 C46.1 C47.1 C48.1 C49.1 C50.1 DA2.3(GND) DD5.10(VSS) DD5.19(VSSA) DD5.26(VSS) DD5.49(VSS) DD5.74(VSS) DD5.99(VSS) R32.1 R44.1 R45.1 S1.2 S2.2 ZQ1.2(GND) ZQ1.4(GND)
VDD: C34.2 C36.2 C37.2 C38.2 C39.2 C42.2 DD5.11(VDD) DD5.27(VDD) DD5.50(VDD) DD5.75(VDD) DD5.100(VDD) R41.2 R46.2
VDDA: C35.2 DA2.1(VIN) FB1.1
VREF_MCU: C41.2 C44.2 DA2.2(VOUT) DD5.20(VREF+)
ADC1: DD5.30(PA6)  [project net ADC1_4]
ADC2: DD5.32(PC4)  [project net ADC2_4]
ADC3: DD5.35(PB1)  [project net ADC3_4]
ADC4: DD5.18(PC3_C)  [project net ADC4_4]
BUTTON: C49.2 DD5.92(PB6) R41.1 S1.1  [project net BUTTON_4]
CAN_RX: DD5.70(PA11) ; port CAN.RX
CAN_TX: DD5.71(PA12) ; port CAN.TX
HRTIM_CHA1: DD5.63(PC6) R33.1  [project net HRTIM_CHA1_4]
HRTIM_CHA2: DD5.64(PC7) R34.1  [project net HRTIM_CHA2_4]
HRTIM_CHB1: DD5.65(PC8) R35.1  [project net HRTIM_CHB1_4]
HRTIM_CHB2: DD5.67(PA8) R36.1  [project net HRTIM_CHB2_4]
LED1: DD5.90(PB4) HL1.1  [project net LED1_4]
LED2: DD5.91(PB5) HL2.1  [project net LED2_4]
PWM1_HI: R33.2 R37.2 R43.2 ; port PWM1_HI
PWM1_LO: R34.2 R38.2 R42.2 ; port PWM1_LO
PWM2_HI: R35.2 R39.2 R42.1 ; port PWM2_HI
PWM2_LO: R36.2 R40.2 R43.1 ; port PWM2_LO
RE&DE: DD5.66(PC9) ; port UART1.RE&DE
RESET: C50.2 DD5.14(NRST) R46.1 S2.1  [project net RESET_4]
SWCLOCK: DD5.76(PA14) ; port SWD.SWCLK
SWDIO: DD5.72(PA13) ; port SWD.SWDIO
TIM1_CH1: DD5.39(PE9) R37.1  [project net TIM1_CH1_4]
TIM1_CH1N: DD5.31(PA7) R38.1  [project net TIM1_CH1N_4]
TIM1_CH2: DD5.41(PE11) R39.1  [project net TIM1_CH2_4]
TIM1_CH2N: DD5.34(PB0) R40.1  [project net TIM1_CH2N_4]
UART1_RX: DD5.69(PA10) ; port UART1.RX
UART1_TX: DD5.68(PA9) ; port UART1.TX
UART2_RX: DD5.25(PA3) ; port UART2.RX
UART2_TX: DD5.24(PA2) ; port UART2.TX
USB_N: DD5.53(PB14) ; port USB.USB_DM
USB_P: DD5.54(PB15) ; port USB.USB_DP
NetC40_2: C40.2 C43.2 DD5.21(VDDA) FB1.2
NetC45_2: C45.2 DD5.73(VCAP)
NetC46_2: C46.2 DD5.48(VCAP)
NetC47_2: C47.2 DD5.13(PH1-OSC_OUT) ZQ1.1
NetC48_2: C48.2 DD5.12(PH0-OSC_IN) ZQ1.3
NetDD5_94: DD5.94(BOOT0) R32.2
NetHL1_2: HL1.2 R44.2
NetHL2_2: HL2.2 R45.2

Not connected (* = marked no-connect by the designer): DD5 1(PE2) 2(PE3) 3(PE4) 4(PE5) 5(PE6) 6(VBAT) 7(PC13) 8(PC14-OSC32_IN) 9(PC15-OSC32_OUT) 15(PC0) 16(PC1) 17(PC2_C) 22(PA0) 23(PA1) 28(PA4) 29(PA5) 33(PC5) 36(PB2) 37(PE7) 38(PE8) 40(PE10) 42(PE12) 43(PE13) 44(PE14) 45(PE15) 46(PB10) 47(PB11) 51(PB12) 52(PB13) 55(PD8) 56(PD9) 57(PD10) 58(PD11) 59(PD12) 60(PD13) 61(PD14) 62(PD15) 77(PA15) 78(PC10) 79(PC11) 80(PC12) 81(PD0) 82(PD1) 83(PD2) 84(PD3) 85(PD4) 86(PD5) 87(PD6) 88(PD7) 89(PB3) 93(PB7) 95(PB8) 96(PB9) 97(PE0) 98(PE1)

### Buses and harness runs
bus ADC[1..4] = port ADC[1..4]

### Layout directives
differential pair; differential pair class 90OhmDiff: USB_N, USB_P
mark named USB: USB_N, USB_P
mark named 90 Ом: USB_N, USB_P

### Notes on the sheet
- (near DD5) ADC1_INP3
- (near DD5) ADC2_INP5
- (near DD5) ADC3_INP1
- (near DD5) ADC2_INP4
- Перв. примен.
- Справ. №
- Подп. и дата
- Инв. № дубл.
- Взам. инв. №
- Инв. № подл.
- Изм.
- Лист
- № докум.
- Подп.
- Дата
- Копировал
- Формат А3
- (in symbol STM32H743VIT6) MCU

### Library data of the parts
C34 = Capacitor_4,7u_10_50V_X7R_1206C: Конденсатор 1206C ёмкостью 4,7 мк 10%, 50 В, X7R; Voltage (V): 50; Capacity (nF): 4700; Part Number: Capacitor_4,7u_10_50V_X7R_1206C; Tolerance: 10%; Dielectric: X7R
C35 = Capacitor_0,47u_10_50V_X7R_0603C: Конденсатор 0603C ёмкостью 0,47 мк 10%, 50 В, X7R; Voltage (V): 50; Capacity (nF): 470; Part Number: Capacitor_0,47u_10_50V_X7R_0603C; Tolerance: 10%; Dielectric: X7R
C36-C39 C42-C44 C49 C50 = Capacitor_0,1u_10_50V_X7R_0603C: as C2 on sheet HV_amplifier; Part Number: Capacitor_0,1u_10_50V_X7R_0603C; Tolerance: 10%; Dielectric: X7R
C40 C41 = Capacitor_1u_10_25V_X7R_0603C: as C5 on sheet HV_amplifier; Part Number: Capacitor_1u_10_25V_X7R_0603C; Tolerance: 10%; Dielectric: X7R
C45 C46 = Capacitor_2,2u_10_50V_X7R_1206C: Конденсатор 1206C ёмкостью 2,2 мк 10%, 50 В, X7R; Voltage (V): 50; Capacity (nF): 2200; Part Number: Capacitor_2,2u_10_50V_X7R_1206C; Tolerance: 10%; Dielectric: X7R
C47 C48 = Capacitor_12p_5_50V_NP0_0603C: Конденсатор 0603C ёмкостью 12 п 5%, 50 В, NP0; Voltage (V): 50; Capacity (nF): 0,012; Автор: glebmih; Part Number: Capacitor_12p_5_50V_NP0_0603C; Tolerance: 5%; Dielectric: NP0
DA2 = REF3030AIDBZR: Источник опорного напряжения, 3В; Автор: glebmih; Part Number: REF3030AIDBZR; Datasheet: https://static.chipdip.ru/lib/248/DOC000248445.pdf
DD5 = STM32H743VIT6: Микроконтроллер, 32-Бит, Cortex-M7, 480МГц, 2Мб Flash, 1Мб SRAM, 82 I/O; MF: STMicroelectronics; Автор: glebmih; SnapEDA_Link: https://www.snapeda.com/parts/STM32H743VIT6/STMicroelectronics/view-part/?ref=snap; Package: LQFP-100 STMicroelectronics; Value: *; MP: STM32H743VIT6; Check_prices: https://www.snapeda.com/parts/STM32H743VIT6/STMicroelectronics/view-part/?ref=eda; Part Number: STM32H743VIT6; Datasheet: https://static.chipdip.ru/lib/529/DOC010529789.pdf
FB1 = BLM18AG102SN1D: Дроссель подавления ЭМП; Автор: glebmih; Part Number: BLM18AG102SN1D; Datasheet: https://www.chipdip.ru/product/blm18ag102sn1d-1-kom-0.4a-0603-drossel-podavleniya-murata-9000029220
HL1 HL2 = LED: Светодиод; Part Number: LED
R32 R41 R46 = Resistor_10k_1_0603: Резистор номиналом 10 кОм 1%; Power: *; Part Number: Resistor_10k_1_0603; Tolerance: 1%
R33-R40 = Resistor_200_1_0603: Резистор номиналом 200 Ом 1%; Power: *; Part Number: Resistor_200_1_0603; Tolerance: 1%
R42 R43 = Resistor_0_5_0603: Резистор номиналом 0 Ом 5%; Автор: glebmih; Power: *; Part Number: Resistor_0_5_0603; Tolerance: 5%
R44 R45 = Resistor_1.0k_1_0603: Резистор номиналом 1,0 кОм 1%; Power: *; Part Number: Resistor_1.0k_1_0603; Tolerance: 1%
S1 S2 = TSS-TD-19XA-XTR: Тактовая кнопка; Автор: glebmih; Part Number: TSS-TD-19XA-XTR; Datasheet: https://cdn.promelec.ru/upload/items/2023/04/17/TSS-TD-19XA.pdf
ZQ1 = X322525MOB4SI: Кварцевый резонатор SMD 25 МГц ±10ppm SMD-3225_4P; Автор: rreali; Part Number: X322525MOB4SI; Datasheet: https://datasheet.lcsc.com/lcsc/Yangxing-Tech-X322525MOB4SI_C9006.pdf

## Sheet Connectors.SchDoc: ГАНС с короткой или ультракороткой базой
size 420 x 297 mm; SheetNumber: 6; SheetTotal: 6
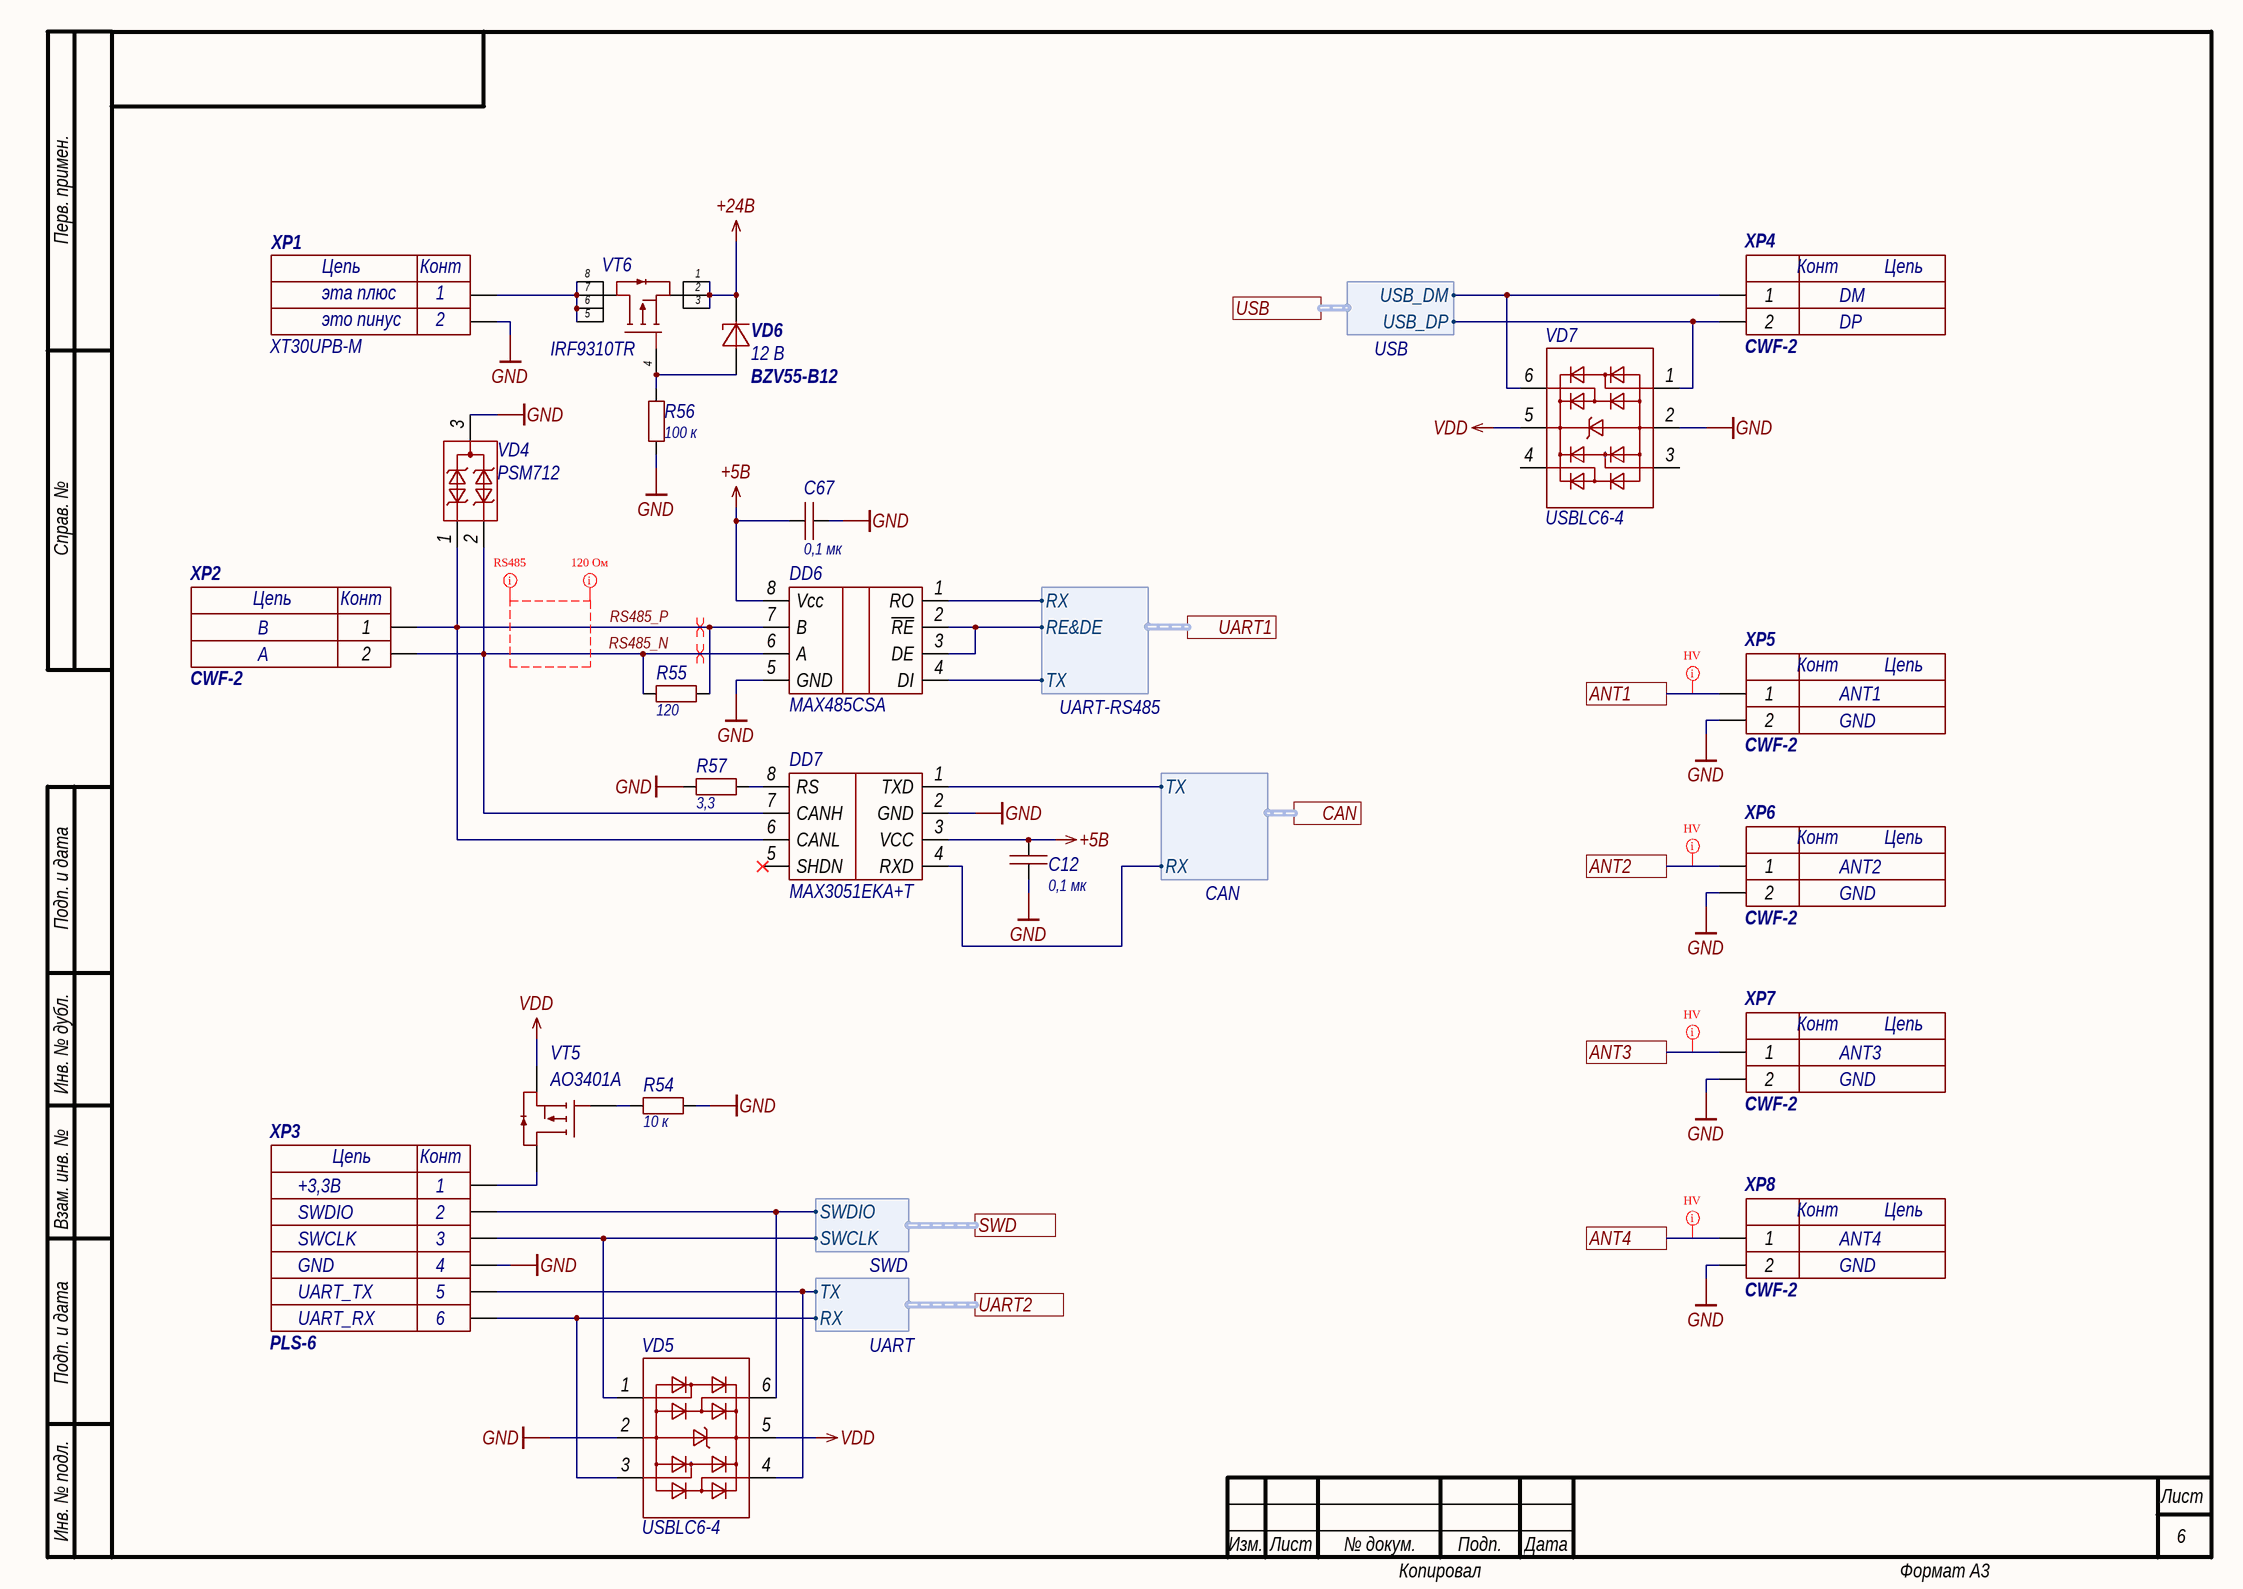
[diagram p7: Connectors.SchDoc]

### Parts
C12  value 0,1 мк  [0603C]  (hidden comment: Capacitor)
C67  value 0,1 мк  [0603C]  (hidden comment: Capacitor)
DD6  MAX485CSA  [SOIC-8]
DD7  MAX3051EKA+T  [SOT23-8]
R54  value 10 к  [0603R]  (hidden comment: Resistor)
R55  value 120  [1206R]  (hidden comment: Resistor)
R56  value 100 к  [0603R]  (hidden comment: Resistor)
R57  value 3,3  [0603R]  (hidden comment: Resistor)
VD4  PSM712  [SOT23-3]
VD5  USBLC6-4  [SOT23-6]
VD6  BZV55-B12  value 12 В  [mini_MELF_3.5mm]
VD7  USBLC6-4  [SOT23-6]
VT5  AO3401A  [SOT23-3]
VT6  IRF9310TR  [SOIC-8]
XP1  XT30UPB-M  Value2: это пинус  Value1: эта плюс  [XT30UPB-M]
XP2  CWF-2  [CWF-2]
XP3  PLS-6  [PLS6]
XP4  CWF-2  [CWF-2]
XP5  CWF-2  [CWF-2]
XP6  CWF-2  [CWF-2]
XP7  CWF-2  [CWF-2]
XP8  CWF-2  [CWF-2]

### Ports
ANT1, ANT2, ANT3, ANT4, CAN (harness CAN), SWD (harness SWD), UART1 (harness UART-RS485), UART2 (harness UART), USB (harness USB)

### Harnesses
SWD: SWDIO, SWCLK
UART: TX, RX
USB: USB_DM, USB_DP
UART-RS485: TX, RX, RE&DE
CAN: TX, RX

### Nets
+5В: C12.2 C67.1 DD6.8(Vcc) DD7.3(VCC)
+24В: VD6.2 VT6.1 VT6.2 VT6.3
GND: C12.1 C67.2 DD6.5(GND) DD7.2(GND) R54.1 R56.1 R57.1 VD4.3 VD5.2 VD7.2 XP1.N XP3.4 XP5.2 XP6.2 XP7.2 XP8.2
VDD: VD5.5 VD7.5 VT5.2
RS485_N: DD6.6(A) DD7.7(CANH) R55.1 VD4.2 XP2.2  [project net RS485_N_6]
RS485_P: DD6.7(B) DD7.6(CANL) R55.2 VD4.1 XP2.1  [project net RS485_P_6]
NetDD6_1: DD6.1(RO) ; port UART1.RX
NetDD6_2: DD6.2(~{RE}) DD6.3(DE) ; port UART1.RE&DE
NetDD6_4: DD6.4(DI) ; port UART1.TX
NetDD7_1: DD7.1(TXD) ; port CAN.TX
NetDD7_4: DD7.4(RXD) ; port CAN.RX
NetDD7_8: DD7.8(RS) R57.2
NetR54_2: R54.2 VT5.1
NetR56_2: R56.2 VD6.1 VT6.4
NetVD5_1: VD5.1 XP3.3 ; port SWD.SWCLK
NetVD5_3: VD5.3 XP3.6 ; port UART2.RX
NetVD5_4: VD5.4 XP3.5 ; port UART2.TX
NetVD5_6: VD5.6 XP3.2 ; port SWD.SWDIO
NetVD7_1: VD7.1 XP4.2 ; port USB.USB_DP
NetVD7_6: VD7.6 XP4.1 ; port USB.USB_DM
NetVT5_3: VT5.3 XP3.1
NetVT6_5: VT6.5 VT6.6 VT6.7 VT6.8 XP1.P
NetXP5_1: XP5.1 ; port ANT1
NetXP6_1: XP6.1 ; port ANT2
NetXP7_1: XP7.1 ; port ANT3
NetXP8_1: XP8.1 ; port ANT4

Not connected (* = marked no-connect by the designer): DD7 5(SHDN)*; VD7 3(11) 4(12)

### Layout directives
differential pair: RS485_N_6, RS485_P_6
mark named RS485: (no net found under the mark)
net class 120OhmDiff: (no net found under the mark)
net class HV; rule Clearance Constraint [Clearance = 1mm]: NetXP5_1, NetXP6_1, NetXP7_1, NetXP8_1

### Notes on the sheet
- DM
- DP
- B
- A
- ANT1
- GND
- ANT2
- ANT3
- +3,3В
- SWDIO
- SWCLK
- ANT4
- UART_TX
- UART_RX
- Перв. примен.
- Справ. №
- Подп. и дата
- Инв. № дубл.
- Взам. инв. №
- Инв. № подл.
- Изм.
- Лист
- № докум.
- Подп.
- Дата
- Копировал
- Формат А3
- (in symbol CWF-2) Конт; Цепь
- (in symbol PLS-6) Цепь; Конт
- (in symbol XT30UPB-M) Цепь; Конт; 1; 2

### Library data of the parts
C12 C67 = Capacitor_0,1u_10_50V_X7R_0603C: as C2 on sheet HV_amplifier; Part Number: Capacitor_0,1u_10_50V_X7R_0603C; Tolerance: 10%; Dielectric: X7R
DD6 = MAX485CSA: RS-485 приёмопередатчик; Part Number: MAX485CSA
DD7 = MAX3051EKA+T: CAN трансивер 1Mbps +3.3В; Автор: glebmih; Part Number: MAX3051EKA+T; Datasheet: https://static.chipdip.ru/lib/876/DOC015876362.pdf
R54 = Resistor_10k_1_0603: Резистор номиналом 10 кОм 1%; Power: *; Part Number: Resistor_10k_1_0603; Tolerance: 1%
R55 = Resistor_120_1_1206: Резистор номиналом 120 Ом 1%; Автор: glebmih; Power: *; Part Number: Resistor_120_1_1206; Tolerance: 1%
R56 = Resistor_100k_1_0603: Резистор номиналом 100 кОм 1%; Power: *; Part Number: Resistor_100k_1_0603; Tolerance: 1%
R57 = Resistor_3.3_1_0603: Резистор номиналом 3,3 Ом 1%; Power: *; Part Number: Resistor_3.3_1_0603; Tolerance: 1%
VD4 = PSM712: Защитный диод для линии RS-485; Part Number: PSM712; Interface: RS-485
VD5 VD7 = USBLC6-4: Сборка защитных диодов для USB; ComponentLink1Description: Shop; ComponentLink1URL: https://www.chipdip.ru/product0/8001780508; Part Number: USBLC6-4
VD6 = BZV55-B12: Стабилитрон 12В, 5%, 0.5Вт; Voltage (V): 12; Current: 5 мА; Power (W): 0.5; Accuracy: 0,02; Автор: rreali; Part Number: BZV55-B12
VT5 = AO3401A: P-канальный MOSFET; Part Number: AO3401A
VT6 = IRF9310TR: P-канальный MOSFET, 30 В, 20 А; Voltage (V): 30 В; Current (A): 20 А; Автор: glebmih; Part Number: IRF9310TR
XP1 = XT30UPB-M: 2-пиновый разъем с ключом; System: Connector; Автор: rreali; Part Number: XT30UPB-M
XP2 = CWF-2: 2-пиновый разъем с ключом; System: Connector; Автор: rreali; Value1: {Value1}; Value2: {Value2}; Part Number: CWF-2; Datasheet: https://static.chipdip.ru/lib/413/DOC001413777.pdf
XP3 = PLS-6: Гребенка 6 пинов; Value1: {Value1}; Value2: {Value2}; Value3: {Value3}; Value4: {Value4}; Value5: {Value5}; Value6: {Value6}; System: Connector; Автор: glebmih; Part Number: PLS-6
XP4-XP8 = CWF-2: 2-пиновый разъем с ключом; Value2: {Value2}; Value1: {Value1}; System: Connector; Автор: rreali; Part Number: CWF-2; Datasheet: https://static.chipdip.ru/lib/413/DOC001413777.pdf

## Nets that join several sheets
+24В: HV_amplifier (6 pins), Connectors (VD6.2 VT6.1 VT6.2 VT6.3)
GND: HV_amplifier (23 pins), Analog_Filter (13 pins), MCU (31 pins), Connectors (16 pins)
VDD: MCU (13 pins), Connectors (VD5.5 VD7.5 VT5.2)
VDDA: Analog_Filter (7 pins), MCU (C35.2 DA2.1 FB1.1)

## Assembly variants
01: not fitted C12 DD7 R37 R38 R39 R40 R57